# Altium project multi_channel.PrjPcb (part 1 of 2)
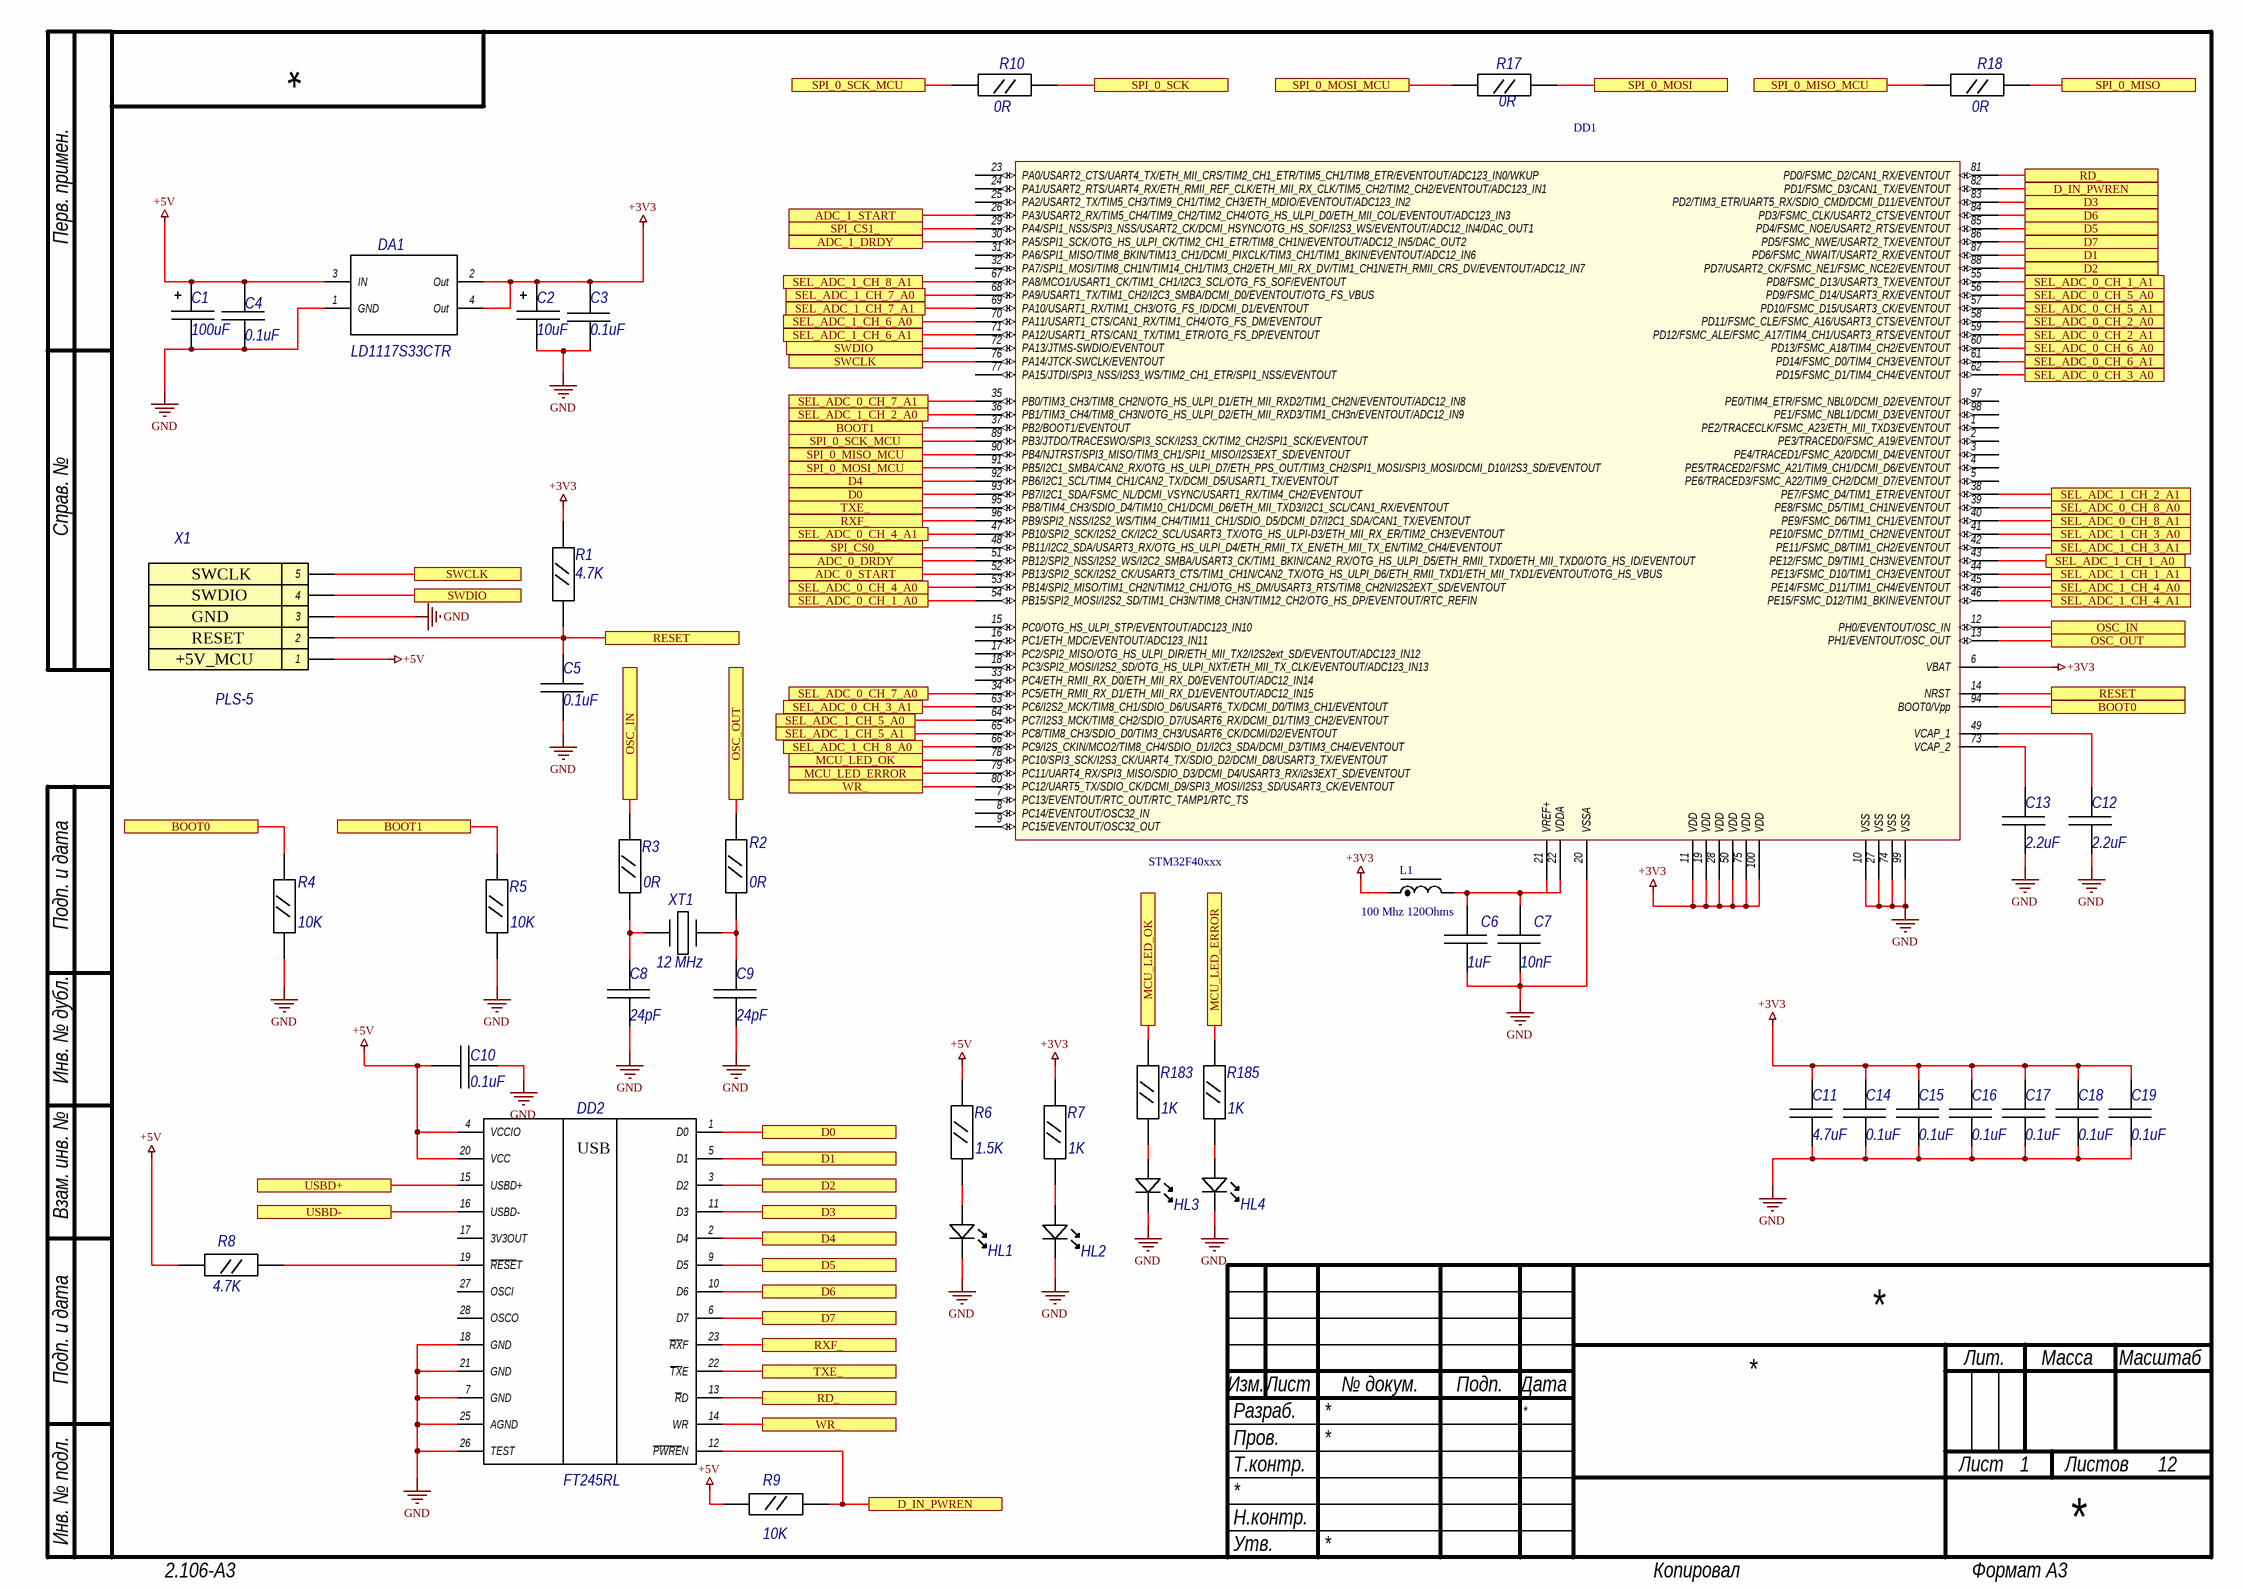
[diagram p0: MCU.SchDoc]
13 sheets, 471 parts. Net scope: flat (ports and power ports of the same name join across sheets).
Board file: multi_channel_pcb.PcbDoc
Sheets:
  MCU.SchDoc
  ADC_0.SchDoc
  ADC_0_MUL.SchDoc
  ADC_1.SchDoc
  ADC_1_MUL.SchDoc
  Filter1.SchDoc
  Filter2.SchDoc
  Filter3.SchDoc
  Filter4.SchDoc
  Filter5.SchDoc
  Filter6.SchDoc
  Connectors.SchDoc
  Filter7.SchDoc

## Sheet MCU.SchDoc
size 420 x 297 mm; SheetNumber: 1; SheetTotal: 12

### Parts
C1  100uF  [CT_SMD_A]
C2  10uF  [CT_SMD_A]
C3  0.1uF  [C0603]
C4  0.1uF  [C0603]
C5  0.1uF  [C0603]
C6  1uF  [C0603]
C7  10nF  [C0603]
C8  24pF  [C0603]
C9  24pF  [C0603]
C10  0.1uF  [C0603]
C11  4.7uF  [C0603]
C12  2.2uF  [C0603]
C13  2.2uF  [C0603]
C14  0.1uF  [C0603]
C15  0.1uF  [C0603]
C16  0.1uF  [C0603]
C17  0.1uF  [C0603]
C18  0.1uF  [C0603]
C19  0.1uF  [C0603]
DA1  LD1117S33CTR  [SOT-223(DCY)]
DD1  STM32F40xxx  [QFP50P1600X1600X160-100N]
DD2  FT245RL  [SSOP-28N]
HL1  GREEN  [LED_0603]  (value not drawn)
HL2  GREEN  [LED_0603]  (value not drawn)
HL3  GREEN  [LED_0603]  (value not drawn)
HL4  GREEN  [LED_0603]  (value not drawn)
L1  100 Mhz 120Ohms  [0805]
R1  4.7K  [R0603]
R2  0R  [R0603]
R3  0R  [R0603]
R4  10K  [R0603]
R5  10K  [R0603]
R6  1.5K  [R0603]
R7  1K  [R0603]
R8  4.7K  [R0603]
R9  10K  [R0603]
R10  0R  [R0603]
R17  0R  [R0603]
R18  0R  [R0603]
R183  1K  [R0603]
R185  1K  [R0603]
X1  PLS-5  [PLS-5]
XT1  12 MHz  [HC49/US]

### Ports
ADC_0_DRDY, ADC_0_START, ADC_1_DRDY, ADC_1_START, BOOT0, BOOT1, D0, D1, D2, D3, D4, D5, D6, D7, D_IN_PWREN, MCU_LED_ERROR, MCU_LED_OK, OSC_IN, OSC_OUT, RD_, RESET, RXF_, SEL_ADC_0_CH_1_A0, SEL_ADC_0_CH_1_A1, SEL_ADC_0_CH_2_A0, SEL_ADC_0_CH_2_A1, SEL_ADC_0_CH_3_A0, SEL_ADC_0_CH_3_A1, SEL_ADC_0_CH_4_A0, SEL_ADC_0_CH_4_A1, SEL_ADC_0_CH_5_A0, SEL_ADC_0_CH_5_A1, SEL_ADC_0_CH_6_A0, SEL_ADC_0_CH_6_A1, SEL_ADC_0_CH_7_A0, SEL_ADC_0_CH_7_A1, SEL_ADC_0_CH_8_A0, SEL_ADC_0_CH_8_A1, SEL_ADC_1_CH_1_A0, SEL_ADC_1_CH_1_A1, SEL_ADC_1_CH_2_A0, SEL_ADC_1_CH_2_A1, SEL_ADC_1_CH_3_A0, SEL_ADC_1_CH_3_A1, SEL_ADC_1_CH_4_A0, SEL_ADC_1_CH_4_A1, SEL_ADC_1_CH_5_A0, SEL_ADC_1_CH_5_A1, SEL_ADC_1_CH_6_A0, SEL_ADC_1_CH_6_A1, SEL_ADC_1_CH_7_A0, SEL_ADC_1_CH_7_A1, SEL_ADC_1_CH_8_A0, SEL_ADC_1_CH_8_A1, SPI_0_MISO, SPI_0_MISO_MCU, SPI_0_MOSI, SPI_0_MOSI_MCU, SPI_0_SCK, SPI_0_SCK_MCU, SPI_CS0_, SPI_CS1_, SWCLK, SWDIO, TXE_, USBD+, USBD-, WR_

### Nets
+3V3: C2.1 C3.2 C11.2 C14.2 C15.2 C16.2 C17.2 C18.2 C19.2 DA1.2(Out) DA1.4(Out) DD1.6(VBAT) DD1.11(VDD) DD1.19(VDD) DD1.28(VDD) DD1.50(VDD) DD1.75(VDD) DD1.100(VDD) L1.1 R1.2 R7.2
+5V: C1.1 C4.2 C10.2 DA1.3(IN) DD2.4(VCCIO) DD2.20(VCC) R6.2 R8.2 R9.1 X1.1
GND: C1.2 C2.2 C3.1 C4.1 C5.1 C6.1 C7.1 C8.1 C9.1 C10.1 C11.1 C12.1 C13.1 C14.1 C15.1 C16.1 C17.1 C18.1 C19.1 DA1.1(GND) DD1.10(VSS) DD1.20(VSSA) DD1.27(VSS) DD1.74(VSS) DD1.99(VSS) DD2.7(GND) DD2.18(GND) DD2.21(GND) DD2.25(AGND) DD2.26(TEST) HL1.K HL2.K HL3.K HL4.K R4.1 R5.1 X1.3
NetB1_34: R17.1 ; port SPI_0_MOSI
NetB1_38: DD1.52(PB13/SPI2_SCK/I2S2_CK/USART3_CTS/TIM1_CH1N/CAN2_TX/OTG_HS_ULPI_D6/ETH_RMII_TXD1/ETH_MII_TXD1/EVENTOUT/OTG_HS_VBUS) ; port ADC_0_START
NetB1_39: DD1.48(PB11/I2C2_SDA/USART3_RX/OTG_HS_ULPI_D4/ETH_RMII_TX_EN/ETH_MII_TX_EN/TIM2_CH4/EVENTOUT) ; port SPI_CS0_
NetB1_40: R10.1 ; port SPI_0_SCK
NetB1_43: R18.1 ; port SPI_0_MISO
NetB1_47: DD1.51(PB12/SPI2_NSS/I2S2_WS/I2C2_SMBA/USART3_CK/TIM1_BKIN/CAN2_RX/OTG_HS_ULPI_D5/ETH_RMII_TXD0/ETH_MII_TXD0/OTG_HS_ID/EVENTOUT) ; port ADC_0_DRDY
NetB2_38: DD1.26(PA3/USART2_RX/TIM5_CH4/TIM9_CH2/TIM2_CH4/OTG_HS_ULPI_D0/ETH_MII_COL/EVENTOUT/ADC123_IN3) ; port ADC_1_START
NetB2_39: DD1.29(PA4/SPI1_NSS/SPI3_NSS/USART2_CK/DCMI_HSYNC/OTG_HS_SOF/I2S3_WS/EVENTOUT/ADC12_IN4/DAC_OUT1) ; port SPI_CS1_
NetB2_47: DD1.30(PA5/SPI1_SCK/OTG_HS_ULPI_CK/TIM2_CH1_ETR/TIM8_CH1N/EVENTOUT/ADC12_IN5/DAC_OUT2) ; port ADC_1_DRDY
NetC5_2: C5.2 DD1.14(NRST) R1.1 X1.2 ; port RESET
NetC6_2: C6.2 C7.2 DD1.21(VREF+) DD1.22(VDDA) L1.2
NetC8_2: C8.2 R3.1 XT1.2(OUT)
NetC9_2: C9.2 R2.1 XT1.1(IN)
NetC12_2: C12.2 DD1.49(VCAP_1)
NetC13_2: C13.2 DD1.73(VCAP_2)
NetDD1_12: DD1.12(PH0/EVENTOUT/OSC_IN) R3.2 ; port OSC_IN
NetDD1_13: DD1.13(PH1/EVENTOUT/OSC_OUT) R2.2 ; port OSC_OUT
NetDD1_34: DD1.34(PC5/ETH_RMII_RX_D1/ETH_MII_RX_D1/EVENTOUT/ADC12_IN15) ; port SEL_ADC_0_CH_7_A0
NetDD1_35: DD1.35(PB0/TIM3_CH3/TIM8_CH2N/OTG_HS_ULPI_D1/ETH_MII_RXD2/TIM1_CH2N/EVENTOUT/ADC12_IN8) ; port SEL_ADC_0_CH_7_A1
NetDD1_36: DD1.36(PB1/TIM3_CH4/TIM8_CH3N/OTG_HS_ULPI_D2/ETH_MII_RXD3/TIM1_CH3n/EVENTOUT/ADC12_IN9) ; port SEL_ADC_1_CH_2_A0
NetDD1_37: DD1.37(PB2/BOOT1/EVENTOUT) R5.2 ; port BOOT1
NetDD1_38: DD1.38(PE7/FSMC_D4/TIM1_ETR/EVENTOUT) ; port SEL_ADC_1_CH_2_A1
NetDD1_39: DD1.39(PE8/FSMC_D5/TIM1_CH1N/EVENTOUT) ; port SEL_ADC_0_CH_8_A0
NetDD1_40: DD1.40(PE9/FSMC_D6/TIM1_CH1/EVENTOUT) ; port SEL_ADC_0_CH_8_A1
NetDD1_41: DD1.41(PE10/FSMC_D7/TIM1_CH2N/EVENTOUT) ; port SEL_ADC_1_CH_3_A0
NetDD1_42: DD1.42(PE11/FSMC_D8/TIM1_CH2/EVENTOUT) ; port SEL_ADC_1_CH_3_A1
NetDD1_43: DD1.43(PE12/FSMC_D9/TIM1_CH3N/EVENTOUT) ; port SEL_ADC_1_CH_1_A0
NetDD1_44: DD1.44(PE13/FSMC_D10/TIM1_CH3/EVENTOUT) ; port SEL_ADC_1_CH_1_A1
NetDD1_45: DD1.45(PE14/FSMC_D11/TIM1_CH4/EVENTOUT) ; port SEL_ADC_1_CH_4_A0
NetDD1_46: DD1.46(PE15/FSMC_D12/TIM1_BKIN/EVENTOUT) ; port SEL_ADC_1_CH_4_A1
NetDD1_47: DD1.47(PB10/SPI2_SCK/I2S2_CK/I2C2_SCL/USART3_TX/OTG_HS_ULPI-D3/ETH_MII_RX_ER/TIM2_CH3/EVENTOUT) ; port SEL_ADC_0_CH_4_A1
NetDD1_53: DD1.53(PB14/SPI2_MISO/TIM1_CH2N/TIM12_CH1/OTG_HS_DM/USART3_RTS/TIM8_CH2N/I2S2EXT_SD/EVENTOUT) ; port SEL_ADC_0_CH_4_A0
NetDD1_54: DD1.54(PB15/SPI2_MOSI/I2S2_SD/TIM1_CH3N/TIM8_CH3N/TIM12_CH2/OTG_HS_DP/EVENTOUT/RTC_REFIN) ; port SEL_ADC_0_CH_1_A0
NetDD1_55: DD1.55(PD8/FSMC_D13/USART3_TX/EVENTOUT) ; port SEL_ADC_0_CH_1_A1
NetDD1_56: DD1.56(PD9/FSMC_D14/USART3_RX/EVENTOUT) ; port SEL_ADC_0_CH_5_A0
NetDD1_57: DD1.57(PD10/FSMC_D15/USART3_CK/EVENTOUT) ; port SEL_ADC_0_CH_5_A1
NetDD1_58: DD1.58(PD11/FSMC_CLE/FSMC_A16/USART3_CTS/EVENTOUT) ; port SEL_ADC_0_CH_2_A0
NetDD1_59: DD1.59(PD12/FSMC_ALE/FSMC_A17/TIM4_CH1/USART3_RTS/EVENTOUT) ; port SEL_ADC_0_CH_2_A1
NetDD1_60: DD1.60(PD13/FSMC_A18/TIM4_CH2/EVENTOUT) ; port SEL_ADC_0_CH_6_A0
NetDD1_61: DD1.61(PD14/FSMC_D0/TIM4_CH3/EVENTOUT) ; port SEL_ADC_0_CH_6_A1
NetDD1_62: DD1.62(PD15/FSMC_D1/TIM4_CH4/EVENTOUT) ; port SEL_ADC_0_CH_3_A0
NetDD1_63: DD1.63(PC6/I2S2_MCK/TIM8_CH1/SDIO_D6/USART6_TX/DCMI_D0/TIM3_CH1/EVENTOUT) ; port SEL_ADC_0_CH_3_A1
NetDD1_64: DD1.64(PC7/I2S3_MCK/TIM8_CH2/SDIO_D7/USART6_RX/DCMI_D1/TIM3_CH2/EVENTOUT) ; port SEL_ADC_1_CH_5_A0
NetDD1_65: DD1.65(PC8/TIM8_CH3/SDIO_D0/TIM3_CH3/USART6_CK/DCMI/D2/EVENTOUT) ; port SEL_ADC_1_CH_5_A1
NetDD1_66: DD1.66(PC9/I2S_CKIN/MCO2/TIM8_CH4/SDIO_D1/I2C3_SDA/DCMI_D3/TIM3_CH4/EVENTOUT) ; port SEL_ADC_1_CH_8_A0
NetDD1_67: DD1.67(PA8/MCO1/USART1_CK/TIM1_CH1/I2C3_SCL/OTG_FS_SOF/EVENTOUT) ; port SEL_ADC_1_CH_8_A1
NetDD1_68: DD1.68(PA9/USART1_TX/TIM1_CH2/I2C3_SMBA/DCMI_D0/EVENTOUT/OTG_FS_VBUS) ; port SEL_ADC_1_CH_7_A0
NetDD1_69: DD1.69(PA10/USART1_RX/TIM1_CH3/OTG_FS_ID/DCMI_D1/EVENTOUT) ; port SEL_ADC_1_CH_7_A1
NetDD1_70: DD1.70(PA11/USART1_CTS/CAN1_RX/TIM1_CH4/OTG_FS_DM/EVENTOUT) ; port SEL_ADC_1_CH_6_A0
NetDD1_71: DD1.71(PA12/USART1_RTS/CAN1_TX/TIM1_ETR/OTG_FS_DP/EVENTOUT) ; port SEL_ADC_1_CH_6_A1
NetDD1_72: DD1.72(PA13/JTMS-SWDIO/EVENTOUT) X1.4 ; port SWDIO
NetDD1_76: DD1.76(PA14/JTCK-SWCLK/EVENTOUT) X1.5 ; port SWCLK
NetDD1_78: DD1.78(PC10/SPI3_SCK/I2S3_CK/UART4_TX/SDIO_D2/DCMI_D8/USART3_TX/EVENTOUT) R183.2 ; port MCU_LED_OK
NetDD1_79: DD1.79(PC11/UART4_RX/SPI3_MISO/SDIO_D3/DCMI_D4/USART3_RX/i2s3EXT_SD/EVENTOUT) R185.2 ; port MCU_LED_ERROR
NetDD1_80: DD1.80(PC12/UART5_TX/SDIO_CK/DCMI_D9/SPI3_MOSI/I2S3_SD/USART3_CK/EVENTOUT) DD2.14(WR) ; port WR_
NetDD1_81: DD1.81(PD0/FSMC_D2/CAN1_RX/EVENTOUT) DD2.13(~{R}D) ; port RD_
NetDD1_82: DD1.82(PD1/FSMC_D3/CAN1_TX/EVENTOUT) DD2.12(~{PWRE}N) R9.2 ; port D_IN_PWREN
NetDD1_83: DD1.83(PD2/TIM3_ETR/UART5_RX/SDIO_CMD/DCMI_D11/EVENTOUT) DD2.11(D3) ; port D3
NetDD1_84: DD1.84(PD3/FSMC_CLK/USART2_CTS/EVENTOUT) DD2.10(D6) ; port D6
NetDD1_85: DD1.85(PD4/FSMC_NOE/USART2_RTS/EVENTOUT) DD2.9(D5) ; port D5
NetDD1_86: DD1.86(PD5/FSMC_NWE/USART2_TX/EVENTOUT) DD2.6(D7) ; port D7
NetDD1_87: DD1.87(PD6/FSMC_NWAIT/USART2_RX/EVENTOUT) DD2.5(D1) ; port D1
NetDD1_88: DD1.88(PD7/USART2_CK/FSMC_NE1/FSMC_NCE2/EVENTOUT) DD2.3(D2) ; port D2
NetDD1_89: DD1.89(PB3/JTDO/TRACESWO/SPI3_SCK/I2S3_CK/TIM2_CH2/SPI1_SCK/EVENTOUT) R10.2 ; port SPI_0_SCK_MCU
NetDD1_90: DD1.90(PB4/NJTRST/SPI3_MISO/TIM3_CH1/SPI1_MISO/I2S3EXT_SD/EVENTOUT) R18.2 ; port SPI_0_MISO_MCU
NetDD1_91: DD1.91(PB5/I2C1_SMBA/CAN2_RX/OTG_HS_ULPI_D7/ETH_PPS_OUT/TIM3_CH2/SPI1_MOSI/SPI3_MOSI/DCMI_D10/I2S3_SD/EVENTOUT) R17.2 ; port SPI_0_MOSI_MCU
NetDD1_92: DD1.92(PB6/I2C1_SCL/TIM4_CH1/CAN2_TX/DCMI_D5/USART1_TX/EVENTOUT) DD2.2(D4) ; port D4
NetDD1_93: DD1.93(PB7/I2C1_SDA/FSMC_NL/DCMI_VSYNC/USART1_RX/TIM4_CH2/EVENTOUT) DD2.1(D0) ; port D0
NetDD1_94: DD1.94(BOOT0/Vpp) R4.2 ; port BOOT0
NetDD1_95: DD1.95(PB8/TIM4_CH3/SDIO_D4/TIM10_CH1/DCMI_D6/ETH_MII_TXD3/I2C1_SCL/CAN1_RX/EVENTOUT) DD2.22(~{TX}E) ; port TXE_
NetDD1_96: DD1.96(PB9/SPI2_NSS/I2S2_WS/TIM4_CH4/TIM11_CH1/SDIO_D5/DCMI_D7/I2C1_SDA/CAN1_TX/EVENTOUT) DD2.23(~{RX}F) ; port RXF_
NetDD2_15: DD2.15(USBD+) ; port USBD+
NetDD2_16: DD2.16(USBD-) ; port USBD-
NetDD2_19: DD2.19(~{RESE}T) R8.1
NetHL1_A: HL1.A R6.1
NetHL2_A: HL2.A R7.1
NetHL3_A: HL3.A R183.1
NetHL4_A: HL4.A R185.1

Not connected (* = marked no-connect by the designer): DD1 1(PE2/TRACECLK/FSMC_A23/ETH_MII_TXD3/EVENTOUT) 2(PE3/TRACED0/FSMC_A19/EVENTOUT) 3(PE4/TRACED1/FSMC_A20/DCMI_D4/EVENTOUT) 4(PE5/TRACED2/FSMC_A21/TIM9_CH1/DCMI_D6/EVENTOUT) 5(PE6/TRACED3/FSMC_A22/TIM9_CH2/DCMI_D7/EVENTOUT) 7(PC13/EVENTOUT/RTC_OUT/RTC_TAMP1/RTC_TS) 8(PC14/EVENTOUT/OSC32_IN) 9(PC15/EVENTOUT/OSC32_OUT) 15(PC0/OTG_HS_ULPI_STP/EVENTOUT/ADC123_IN10) 16(PC1/ETH_MDC/EVENTOUT/ADC123_IN11) 17(PC2/SPI2_MISO/OTG_HS_ULPI_DIR/ETH_MII_TX2/I2S2ext_SD/EVENTOUT/ADC123_IN12) 18(PC3/SPI2_MOSI/I2S2_SD/OTG_HS_ULPI_NXT/ETH_MII_TX_CLK/EVENTOUT/ADC123_IN13) 23(PA0/USART2_CTS/UART4_TX/ETH_MII_CRS/TIM2_CH1_ETR/TIM5_CH1/TIM8_ETR/EVENTOUT/ADC123_IN0/WKUP) 24(PA1/USART2_RTS/UART4_RX/ETH_RMII_REF_CLK/ETH_MII_RX_CLK/TIM5_CH2/TIM2_CH2/EVENTOUT/ADC123_IN1) 25(PA2/USART2_TX/TIM5_CH3/TIM9_CH1/TIM2_CH3/ETH_MDIO/EVENTOUT/ADC123_IN2) 31(PA6/SPI1_MISO/TIM8_BKIN/TIM13_CH1/DCMI_PIXCLK/TIM3_CH1/TIM1_BKIN/EVENTOUT/ADC12_IN6) 32(PA7/SPI1_MOSI/TIM8_CH1N/TIM14_CH1/TIM3_CH2/ETH_MII_RX_DV/TIM1_CH1N/ETH_RMII_CRS_DV/EVENTOUT/ADC12_IN7) 33(PC4/ETH_RMII_RX_D0/ETH_MII_RX_D0/EVENTOUT/ADC12_IN14) 77(PA15/JTDI/SPI3_NSS/I2S3_WS/TIM2_CH1_ETR/SPI1_NSS/EVENTOUT) 97(PE0/TIM4_ETR/FSMC_NBL0/DCMI_D2/EVENTOUT) 98(PE1/FSMC_NBL1/DCMI_D3/EVENTOUT); DD2 17(3V3OUT) 27(OSCI) 28(OSCO)

### Notes on the sheet
- SWCLK
- +5V_MCU
- RESET
- GND
- SWDIO
- Перв. примен.
- Справ. №
- Подп. и дата
- Инв. № дубл.
- Взам. инв. №
- Разраб.
- Изм.
- Лист
- № докум.
- Подп.
- Дата
- Лит.
- Масса
- Масштаб
- Пров.
- Т.контр.
- Листов
- Инв. № подл.
- Утв.
- Н.контр.
- 2.106-A3
- Копировал
- Формат А3
- (in symbol FT245RL) USB

### Library data of the parts
C1 C2 = CT_SMD_A: Capacitor tantalum; Package: SMD_A
  C1: Value: 100uF
  C2: Value: 10uF
C3-C19 = CC_SMD_0603: Ceramic Capacitor SMD; Package: 0603
  C3-C5 C10 C14-C19: Value: 0.1uF
  C6: Value: 1uF
  C7: Value: 10nF
  C8 C9: Value: 24pF
  C11: Value: 4.7uF
  C12 C13: Value: 2.2uF
DA1 = LD1117S33CTR: LDO; PartNumber: LD1117S33CTR; Package: SOT-223
DD1 = STM32F40xxx: ARM CortexM4 32b
DD2 = FT245RL: USB to parallel FIFO interface; Manufacturer: FTDI; Desc: Микросхема; Part Number: FT245RL; Package: 28 Pin SSOP
HL1-HL4 = LED_G_SMD_0603: LED GREEN SMD 0603; PartNumber: FYLS-0603PGC; Package: 0603; ComponentLink1URL: http://www.us.kingbright.com/images/catalog/SPEC/APT1608CGCK.pdf; ComponentLink1Description: http://www.us.kingbright.com/images/catalog/SPEC/APT1608CGCK.pdf; Color: GREEN
L1 = FerriteBead_0805: FerriteBead; PartNumber: BLM21PG121SN1D; Package: 0805; Value: 100 Mhz 120Ohms
R1-R10 R17 R18 R183 R185 = R0603: Resistor SMD
  R1 R8: Value: 4.7K
  R2 R3 R10 R17 R18: Value: 0R
  R4 R5 R9: Value: 10K
  R6: Value: 1.5K
  R7 R183 R185: Value: 1K
X1 = PLS-5: 5 pin connector, 2.54 step; PartNumber: 825433-5; Value: PLS-5
XT1 = Quarz HC-49/US 12 MHz: Quarz ESR 50 Ohms, Frequency Stability ±30ppm, Load Capacitance 18 pF; PartNumber: J49SML-F-G-G-K-12M0; Package: HC49/US; ComponentLink1Description: Link; ComponentLink1URL: https://abracon.com/Resonators/ABLS2.pdf; Value: 12 MHz

## Sheet ADC_0.SchDoc
size 420 x 297 mm; SheetNumber: 2; SheetTotal: 13
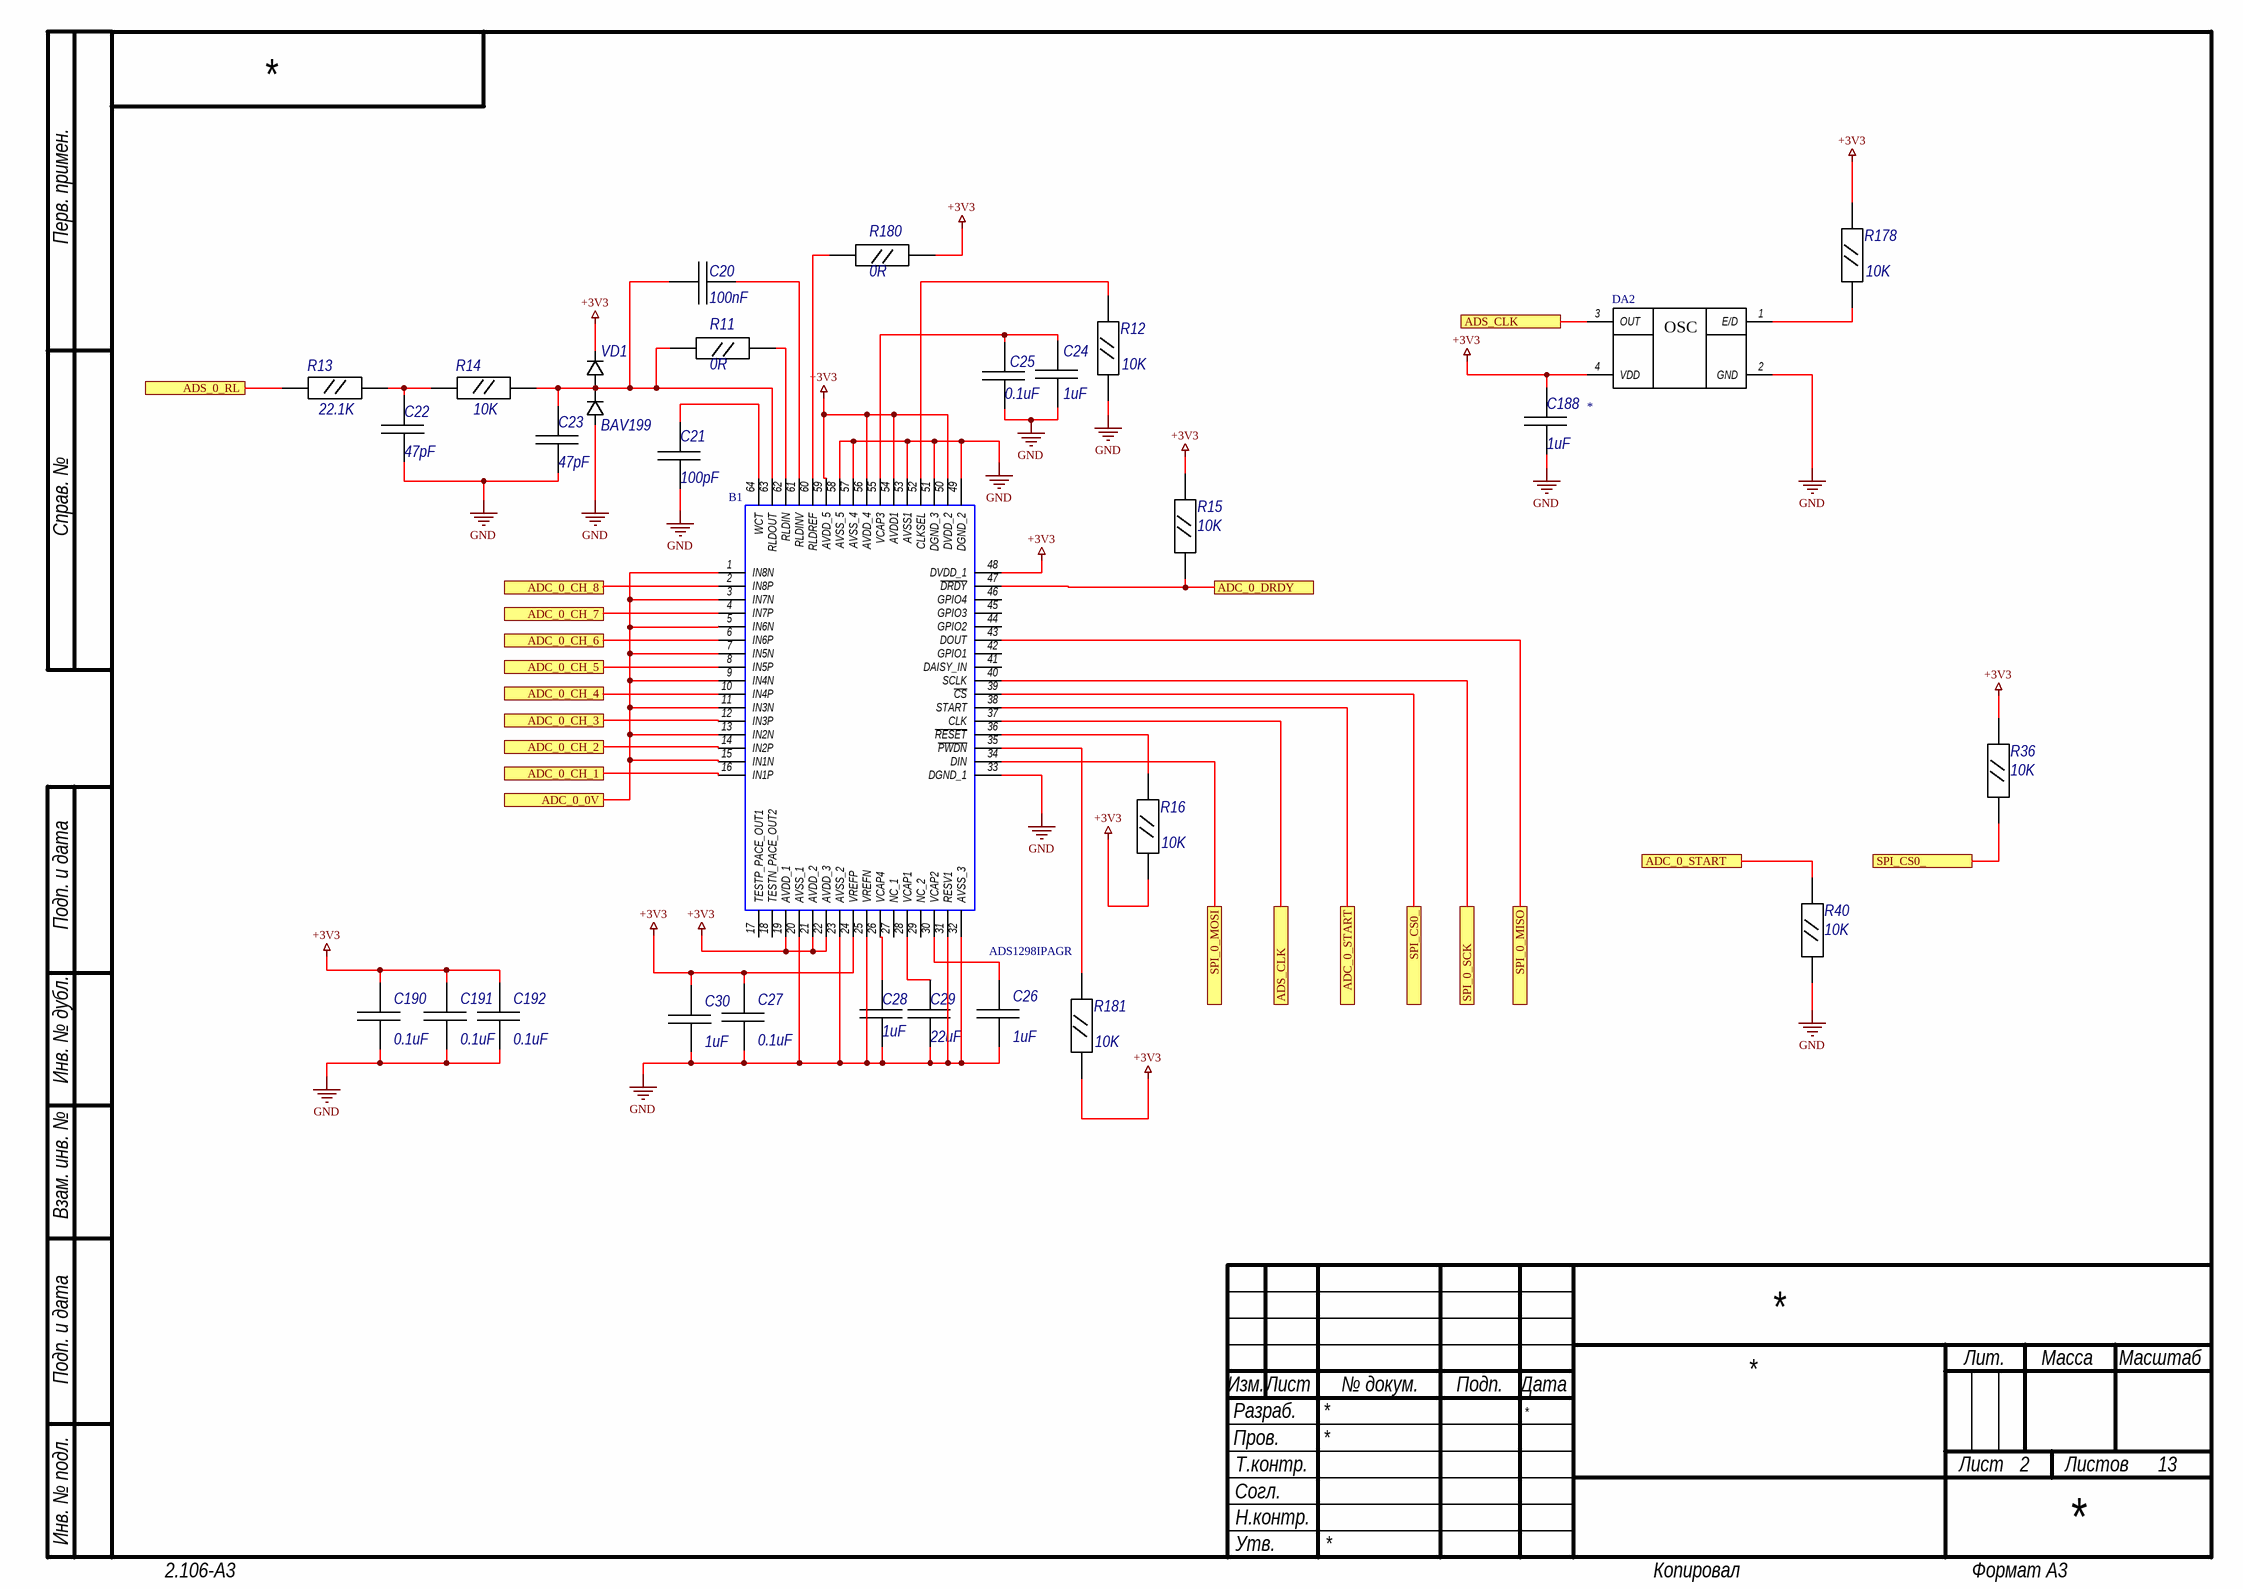
[diagram p1: ADC_0.SchDoc]

### Parts
B1  ADS1298IPAGR  [QFP50P1200X1200X120-64N]
C20  100nF  [C0603]
C21  100pF  [C0603]
C22  47pF  [C0603]
C23  47pF  [C0603]
C24  1uF  [C0603]
C25  0.1uF  [C0603]
C26  1uF  [C0603]
C27  0.1uF  [C0603]
C28  1uF  [C0603]
C29  22uF  [C0603]
C30  1uF  [C0603]
C188  1uF  [C0603]
C190  0.1uF  [C0603]
C191  0.1uF  [C0603]
C192  0.1uF  [C0603]
DA2  *  [Quartz 3.2х3.5х0.8]
R11  0R  [R0603]
R12  10K  [R0603]
R13  22.1K  [R0603]
R14  10K  [R0603]
R15  10K  [R0603]
R16  10K  [R0603]
R36  10K  [R0603]
R40  10K  [R0603]
R178  10K  [R0603]
R180  0R  [R0603]
R181  10K  [R0603]
VD1  BAV199  [SOT23]

### Ports
ADC_0_0V, ADC_0_CH_1, ADC_0_CH_2, ADC_0_CH_3, ADC_0_CH_4, ADC_0_CH_5, ADC_0_CH_6, ADC_0_CH_7, ADC_0_CH_8, ADC_0_DRDY, ADC_0_START, ADS_0_RL, ADS_CLK, SPI_0_MISO, SPI_0_MOSI, SPI_0_SCK, SPI_CS0_

### Nets
+3V3: B1.19(AVDD_1) B1.21(AVDD_2) B1.22(AVDD_3) B1.24(VREFP) B1.48(DVDD_1) B1.50(DVDD_2) B1.54(AVDD1) B1.56(AVDD_4) B1.59(AVDD_5) C27.2 C30.2 C188.2 C190.2 C191.2 C192.2 DA2.4(VDD) R15.2 R16.1 R36.2 R178.2 R180.1 R181.1 VD1.2
GND: B1.20(AVSS_1) B1.23(AVSS_2) B1.25(VREFN) B1.31(RESV1) B1.32(AVSS_3) B1.33(DGND_1) B1.49(DGND_2) B1.51(DGND_3) B1.53(AVSS1) B1.57(AVSS_4) B1.58(AVSS_5) C21.1 C22.1 C23.1 C24.1 C25.1 C26.1 C27.1 C28.1 C29.1 C30.1 C188.1 C190.1 C191.1 C192.1 DA2.2(GND) R12.1 R40.1 VD1.1
NetB1_1: B1.1(IN8N) B1.3(IN7N) B1.5(IN6N) B1.7(IN5N) B1.9(IN4N) B1.11(IN3N) B1.13(IN2N) B1.15(IN1N) ; port ADC_0_0V
NetB1_2: B1.2(IN8P) ; port ADC_0_CH_8
NetB1_4: B1.4(IN7P) ; port ADC_0_CH_7
NetB1_6: B1.6(IN6P) ; port ADC_0_CH_6
NetB1_8: B1.8(IN5P) ; port ADC_0_CH_5
NetB1_10: B1.10(IN4P) ; port ADC_0_CH_4
NetB1_12: B1.12(IN3P) ; port ADC_0_CH_3
NetB1_14: B1.14(IN2P) ; port ADC_0_CH_2
NetB1_16: B1.16(IN1P) ; port ADC_0_CH_1
NetB1_26: B1.26(VCAP4) C28.2
NetB1_28: B1.28(VCAP1) C29.2
NetB1_30: B1.30(VCAP2) C26.2
NetB1_34: B1.34(DIN) ; port SPI_0_MOSI
NetB1_35: B1.35(~{PWDN}) R181.2
NetB1_36: B1.36(~{RESET}) R16.2
NetB1_37: B1.37(CLK) DA2.3(OUT) ; port ADS_CLK
NetB1_38: B1.38(START) R40.2 ; port ADC_0_START
NetB1_39: B1.39(~{CS}) R36.1 ; port SPI_CS0_
NetB1_40: B1.40(SCLK) ; port SPI_0_SCK
NetB1_43: B1.43(DOUT) ; port SPI_0_MISO
NetB1_47: B1.47(~{DRDY}) R15.1 ; port ADC_0_DRDY
NetB1_52: B1.52(CLKSEL) R12.2
NetB1_55: B1.55(VCAP3) C24.2 C25.2
NetB1_60: B1.60(RLDREF) R180.2
NetB1_61: B1.61(RLDINV) C20.1
NetB1_62: B1.62(RLDIN) R11.1
NetB1_63: B1.63(RLDOUT) C20.2 C23.2 R11.2 R14.2 VD1.3
NetB1_64: B1.64(WCT) C21.2
NetC22_2: C22.2 R13.2 R14.1
NetDA2_1: DA2.1(E/D) R178.1
NetR13_1: R13.1 ; port ADS_0_RL

Not connected (* = marked no-connect by the designer): B1 17(TESTP_PACE_OUT1) 18(TESTN_PACE_OUT2) 27(NC_1) 29(NC_2) 41(DAISY_IN) 42(GPIO1) 44(GPIO2) 45(GPIO3) 46(GPIO4)

### Notes on the sheet
- Перв. примен.
- Справ. №
- Подп. и дата
- Инв. № дубл.
- Взам. инв. №
- Разраб.
- Изм.
- Лист
- № докум.
- Подп.
- Дата
- Лит.
- Масса
- Масштаб
- Пров.
- Т.контр.
- Листов
- Инв. № подл.
- Согл.
- Утв.
- Н.контр.
- 2.106-A3
- Копировал
- Формат А3
- (in symbol OSCILLATOR KX-7) OSC

### Library data of the parts
B1 = ADS1298IPAGR: 8-Channel 24-bit ADC With Integrated ECG Front End; Manufacturer_Name: Texas Instruments; Geometry.Height: 1.2mm; Mouser Part Number: 595-ADS1298IPAGR; Mouser Price/Stock: https://www.mouser.co.uk/ProductDetail/Texas-Instruments/ADS1298IPAGR?qs=Z6FgPJT5dDSzK7JhuKfPmw%3D%3D; Manufacturer_Part_Number: ADS1298IPAGR; Datasheet Link: http://www.ti.com/lit/ds/symlink/ads1294.pdf
C20-C30 C188 C190-C192 = CC_SMD_0603: Ceramic Capacitor SMD; Package: 0603
  C20: Value: 100nF
  C21: Value: 100pF
  C22 C23: Value: 47pF
  C24 C26 C28 C30 C188: Value: 1uF
  C25 C27 C190-C192: Value: 0.1uF
  C29: Value: 22uF
DA2 = OSCILLATOR KX-7: Oscillator; Value: *; Package: 4 Lead 3.2x3.5
R11-R16 R36 R40 R178 R180 R181 = R0603: Resistor SMD
  R11 R180: Value: 0R
  R12 R14-R16 R36 R40 R178 R181: Value: 10K
  R13: Value: 22.1K
VD1 = DIODE_BAV199: Diod Schottky; Diode Type: Standard; Package: SOT-23; PartNumber: BAV199; Manufacturer Part Number 1: BAV199

## Sheet ADC_0_MUL.SchDoc
size 420 x 297 mm; SheetNumber: 3; SheetTotal: 13
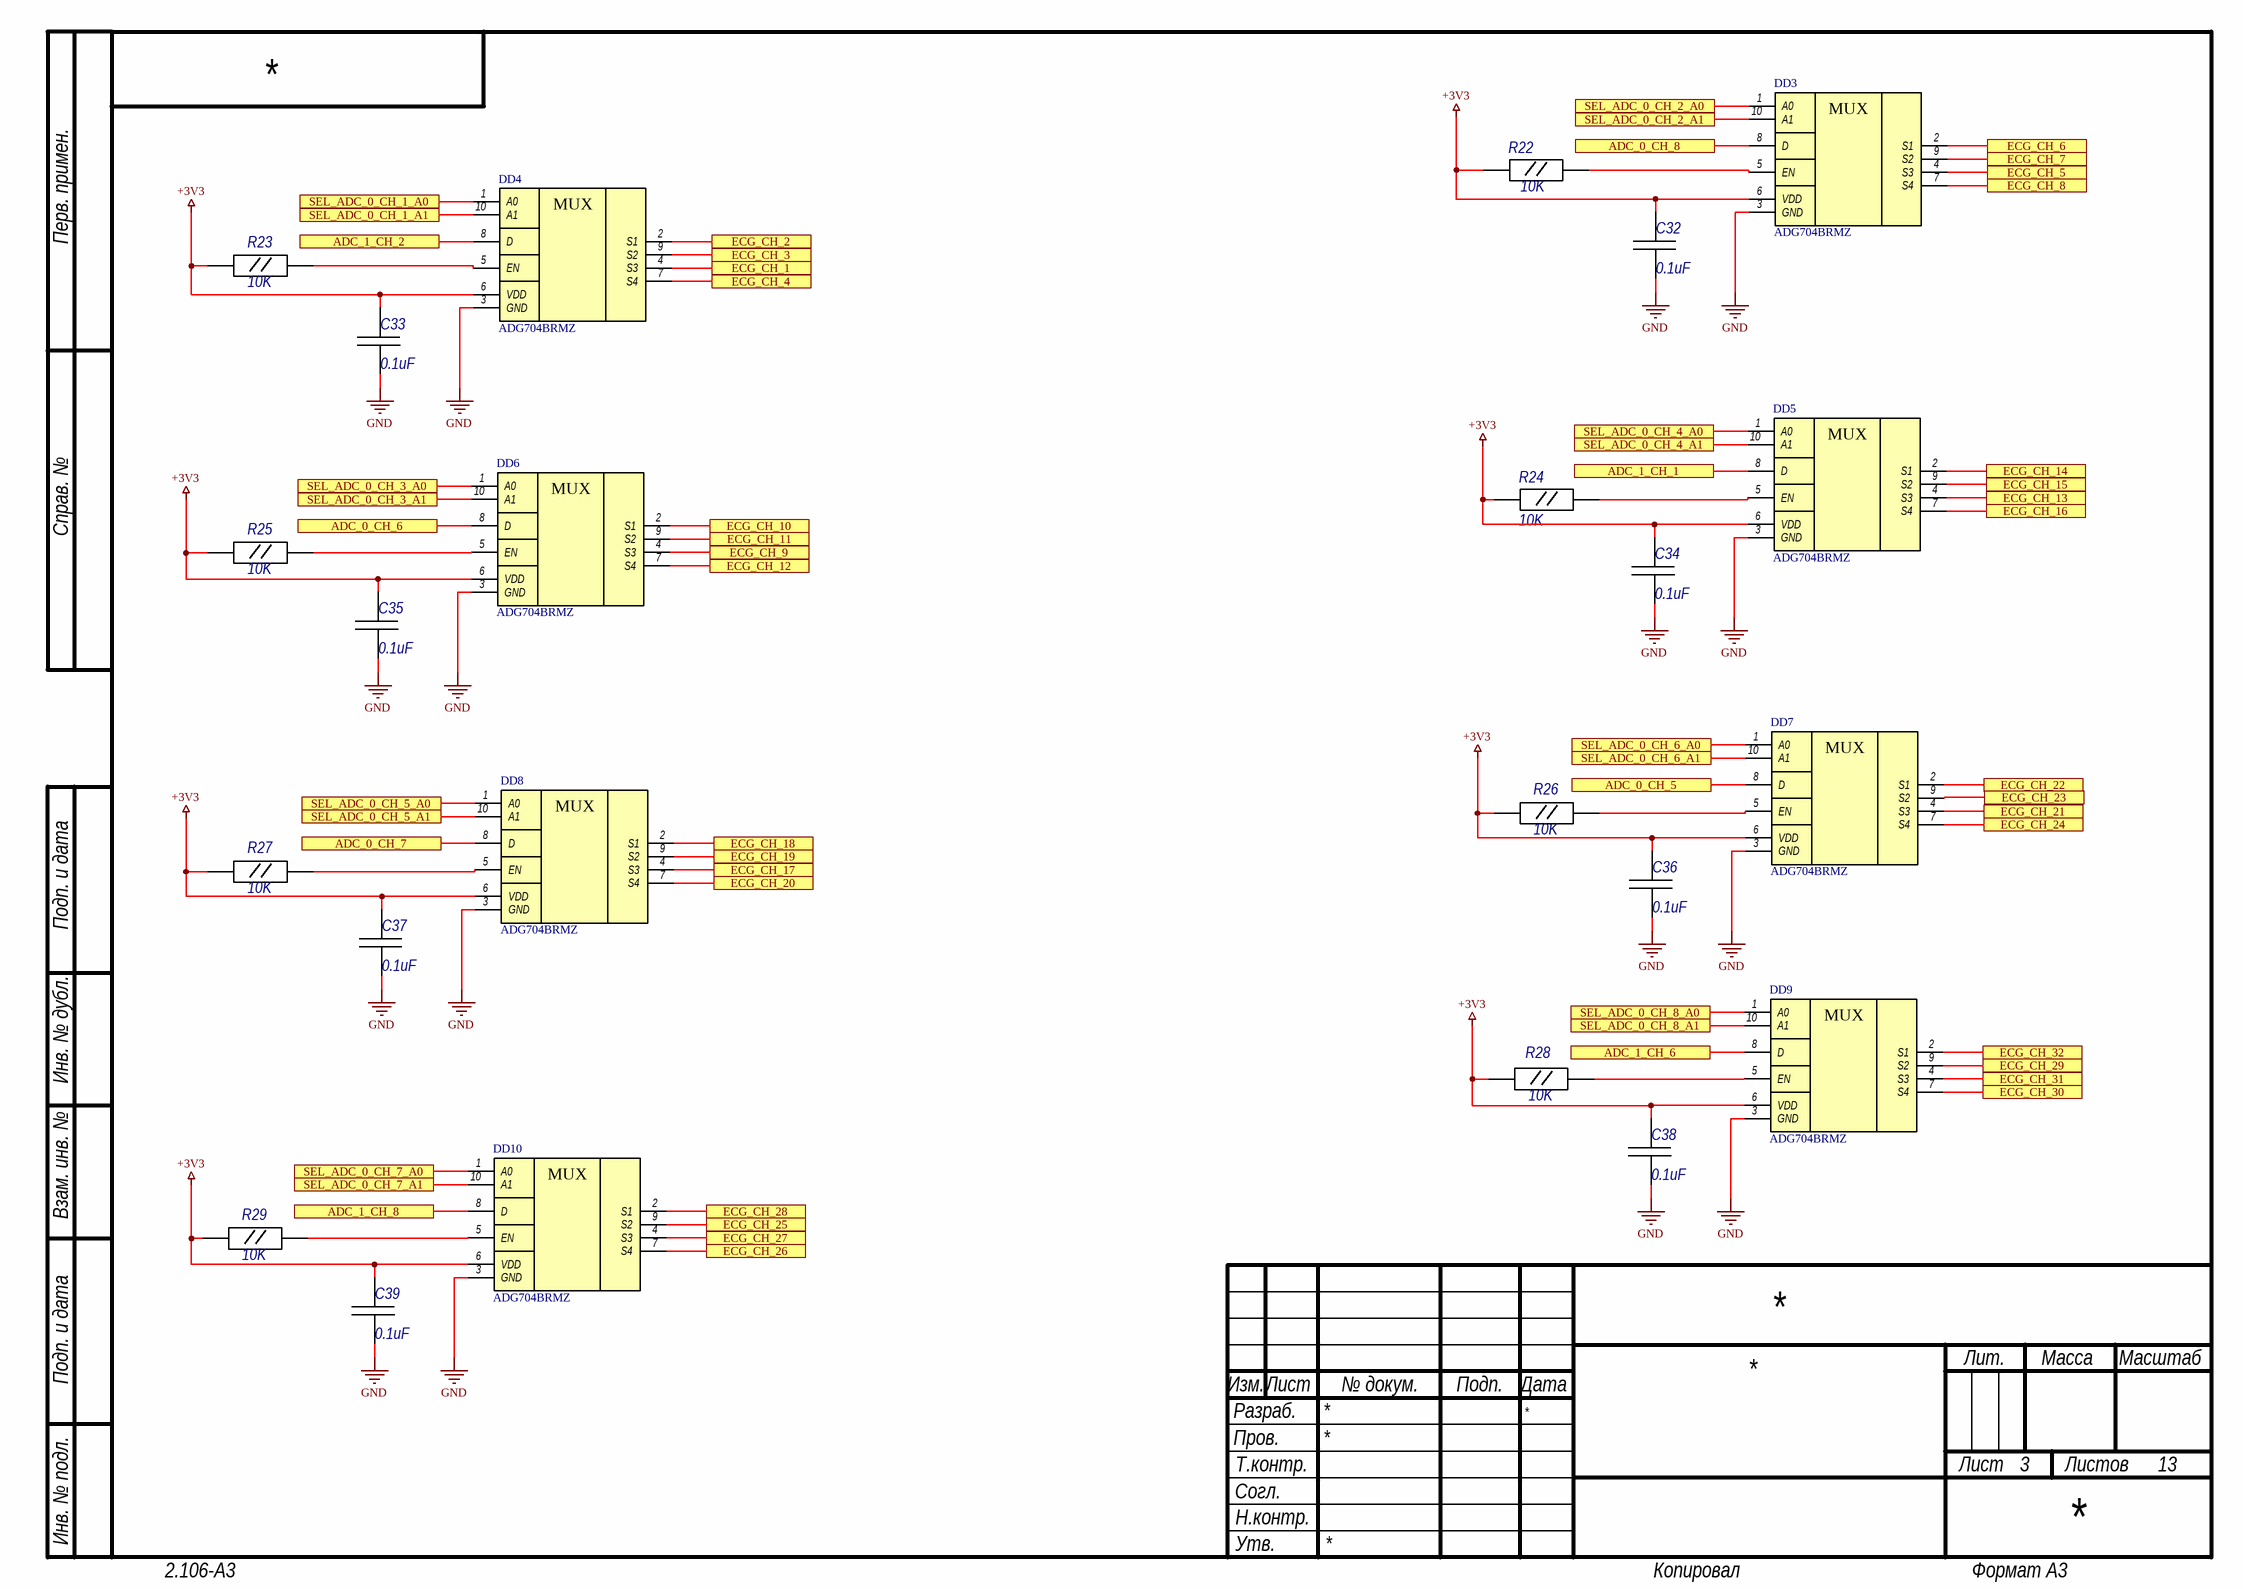
[diagram p2: ADC_0_MUL.SchDoc]

### Parts
C32  0.1uF  [C0603]
C33  0.1uF  [C0603]
C34  0.1uF  [C0603]
C35  0.1uF  [C0603]
C36  0.1uF  [C0603]
C37  0.1uF  [C0603]
C38  0.1uF  [C0603]
C39  0.1uF  [C0603]
DD3  ADG704BRMZ  [MSOP-10]
DD4  ADG704BRMZ  [MSOP-10]
DD5  ADG704BRMZ  [MSOP-10]
DD6  ADG704BRMZ  [MSOP-10]
DD7  ADG704BRMZ  [MSOP-10]
DD8  ADG704BRMZ  [MSOP-10]
DD9  ADG704BRMZ  [MSOP-10]
DD10  ADG704BRMZ  [MSOP-10]
R22  10K  [R0603]
R23  10K  [R0603]
R24  10K  [R0603]
R25  10K  [R0603]
R26  10K  [R0603]
R27  10K  [R0603]
R28  10K  [R0603]
R29  10K  [R0603]

### Ports
ADC_0_CH_5, ADC_0_CH_6, ADC_0_CH_7, ADC_0_CH_8, ADC_1_CH_1, ADC_1_CH_2, ADC_1_CH_6, ADC_1_CH_8, ECG_CH_1, ECG_CH_2, ECG_CH_3, ECG_CH_4, ECG_CH_5, ECG_CH_6, ECG_CH_7, ECG_CH_8, ECG_CH_9, ECG_CH_10, ECG_CH_11, ECG_CH_12, ECG_CH_13, ECG_CH_14, ECG_CH_15, ECG_CH_16, ECG_CH_17, ECG_CH_18, ECG_CH_19, ECG_CH_20, ECG_CH_21, ECG_CH_22, ECG_CH_23, ECG_CH_24, ECG_CH_25, ECG_CH_26, ECG_CH_27, ECG_CH_28, ECG_CH_29, ECG_CH_30, ECG_CH_31, ECG_CH_32, SEL_ADC_0_CH_1_A0, SEL_ADC_0_CH_1_A1, SEL_ADC_0_CH_2_A0, SEL_ADC_0_CH_2_A1, SEL_ADC_0_CH_3_A0, SEL_ADC_0_CH_3_A1, SEL_ADC_0_CH_4_A0, SEL_ADC_0_CH_4_A1, SEL_ADC_0_CH_5_A0, SEL_ADC_0_CH_5_A1, SEL_ADC_0_CH_6_A0, SEL_ADC_0_CH_6_A1, SEL_ADC_0_CH_7_A0, SEL_ADC_0_CH_7_A1, SEL_ADC_0_CH_8_A0, SEL_ADC_0_CH_8_A1

### Nets
+3V3: C32.2 C33.2 C34.2 C35.2 C36.2 C37.2 C38.2 C39.2 DD3.6(VDD) DD4.6(VDD) DD5.6(VDD) DD6.6(VDD) DD7.6(VDD) DD8.6(VDD) DD9.6(VDD) DD10.6(VDD) R22.1 R23.1 R24.1 R25.1 R26.1 R27.1 R28.1 R29.1
GND: C32.1 C33.1 C34.1 C35.1 C36.1 C37.1 C38.1 C39.1 DD3.3(GND) DD4.3(GND) DD5.3(GND) DD6.3(GND) DD7.3(GND) DD8.3(GND) DD9.3(GND) DD10.3(GND)
NetB1_2: DD3.8(D) ; port ADC_0_CH_8
NetB1_4: DD8.8(D) ; port ADC_0_CH_7
NetB1_6: DD6.8(D) ; port ADC_0_CH_6
NetB1_8: DD7.8(D) ; port ADC_0_CH_5
NetB2_2: DD10.8(D) ; port ADC_1_CH_8
NetB2_6: DD9.8(D) ; port ADC_1_CH_6
NetB2_14: DD4.8(D) ; port ADC_1_CH_2
NetB2_16: DD5.8(D) ; port ADC_1_CH_1
NetC61_2: DD4.4(S3) ; port ECG_CH_1
NetC63_2: DD4.2(S1) ; port ECG_CH_2
NetC65_2: DD4.9(S2) ; port ECG_CH_3
NetC67_2: DD4.7(S4) ; port ECG_CH_4
NetC69_2: DD3.4(S3) ; port ECG_CH_5
NetC71_2: DD3.2(S1) ; port ECG_CH_6
NetC73_2: DD3.9(S2) ; port ECG_CH_7
NetC75_2: DD3.7(S4) ; port ECG_CH_8
NetC77_2: DD6.4(S3) ; port ECG_CH_9
NetC79_2: DD6.2(S1) ; port ECG_CH_10
NetC81_2: DD6.9(S2) ; port ECG_CH_11
NetC83_2: DD6.7(S4) ; port ECG_CH_12
NetC85_2: DD5.4(S3) ; port ECG_CH_13
NetC87_2: DD5.2(S1) ; port ECG_CH_14
NetC89_2: DD5.9(S2) ; port ECG_CH_15
NetC91_2: DD5.7(S4) ; port ECG_CH_16
NetC93_2: DD8.4(S3) ; port ECG_CH_17
NetC95_2: DD8.2(S1) ; port ECG_CH_18
NetC97_2: DD8.9(S2) ; port ECG_CH_19
NetC99_2: DD8.7(S4) ; port ECG_CH_20
NetC101_2: DD9.4(S3) ; port ECG_CH_31
NetC103_2: DD9.2(S1) ; port ECG_CH_32
NetC169_2: DD7.4(S3) ; port ECG_CH_21
NetC171_2: DD7.2(S1) ; port ECG_CH_22
NetC173_2: DD7.9(S2) ; port ECG_CH_23
NetC175_2: DD7.7(S4) ; port ECG_CH_24
NetC177_2: DD10.9(S2) ; port ECG_CH_25
NetC179_2: DD10.7(S4) ; port ECG_CH_26
NetC181_2: DD10.4(S3) ; port ECG_CH_27
NetC183_2: DD10.2(S1) ; port ECG_CH_28
NetC185_2: DD9.9(S2) ; port ECG_CH_29
NetC187_2: DD9.7(S4) ; port ECG_CH_30
NetDD1_34: DD10.1(A0) ; port SEL_ADC_0_CH_7_A0
NetDD1_35: DD10.10(A1) ; port SEL_ADC_0_CH_7_A1
NetDD1_39: DD9.1(A0) ; port SEL_ADC_0_CH_8_A0
NetDD1_40: DD9.10(A1) ; port SEL_ADC_0_CH_8_A1
NetDD1_47: DD5.10(A1) ; port SEL_ADC_0_CH_4_A1
NetDD1_53: DD5.1(A0) ; port SEL_ADC_0_CH_4_A0
NetDD1_54: DD4.1(A0) ; port SEL_ADC_0_CH_1_A0
NetDD1_55: DD4.10(A1) ; port SEL_ADC_0_CH_1_A1
NetDD1_56: DD8.1(A0) ; port SEL_ADC_0_CH_5_A0
NetDD1_57: DD8.10(A1) ; port SEL_ADC_0_CH_5_A1
NetDD1_58: DD3.1(A0) ; port SEL_ADC_0_CH_2_A0
NetDD1_59: DD3.10(A1) ; port SEL_ADC_0_CH_2_A1
NetDD1_60: DD7.1(A0) ; port SEL_ADC_0_CH_6_A0
NetDD1_61: DD7.10(A1) ; port SEL_ADC_0_CH_6_A1
NetDD1_62: DD6.1(A0) ; port SEL_ADC_0_CH_3_A0
NetDD1_63: DD6.10(A1) ; port SEL_ADC_0_CH_3_A1
NetDD3_5: DD3.5(EN) R22.2
NetDD4_5: DD4.5(EN) R23.2
NetDD5_5: DD5.5(EN) R24.2
NetDD6_5: DD6.5(EN) R25.2
NetDD7_5: DD7.5(EN) R26.2
NetDD8_5: DD8.5(EN) R27.2
NetDD9_5: DD9.5(EN) R28.2
NetDD10_5: DD10.5(EN) R29.2

### Notes on the sheet
- Перв. примен.
- Справ. №
- Подп. и дата
- Инв. № дубл.
- Взам. инв. №
- Разраб.
- Изм.
- Лист
- № докум.
- Подп.
- Дата
- Лит.
- Масса
- Масштаб
- Пров.
- Т.контр.
- Листов
- Инв. № подл.
- Согл.
- Утв.
- Н.контр.
- 2.106-A3
- Копировал
- Формат А3
- (in symbol MUX_ADG704BRMZ) MUX

### Library data of the parts
C32-C39 = CC_SMD_0603: Ceramic Capacitor SMD; Package: 0603; Value: 0.1uF
DD3-DD10 = MUX_ADG704BRMZ: 4-Channel Multiplexer; PartNumber: ADG704BRMZ; Package: MSOP-10
R22-R29 = R0603: Resistor SMD; Value: 10K

## Sheet ADC_1.SchDoc
size 420 x 297 mm; SheetNumber: 4; SheetTotal: 13
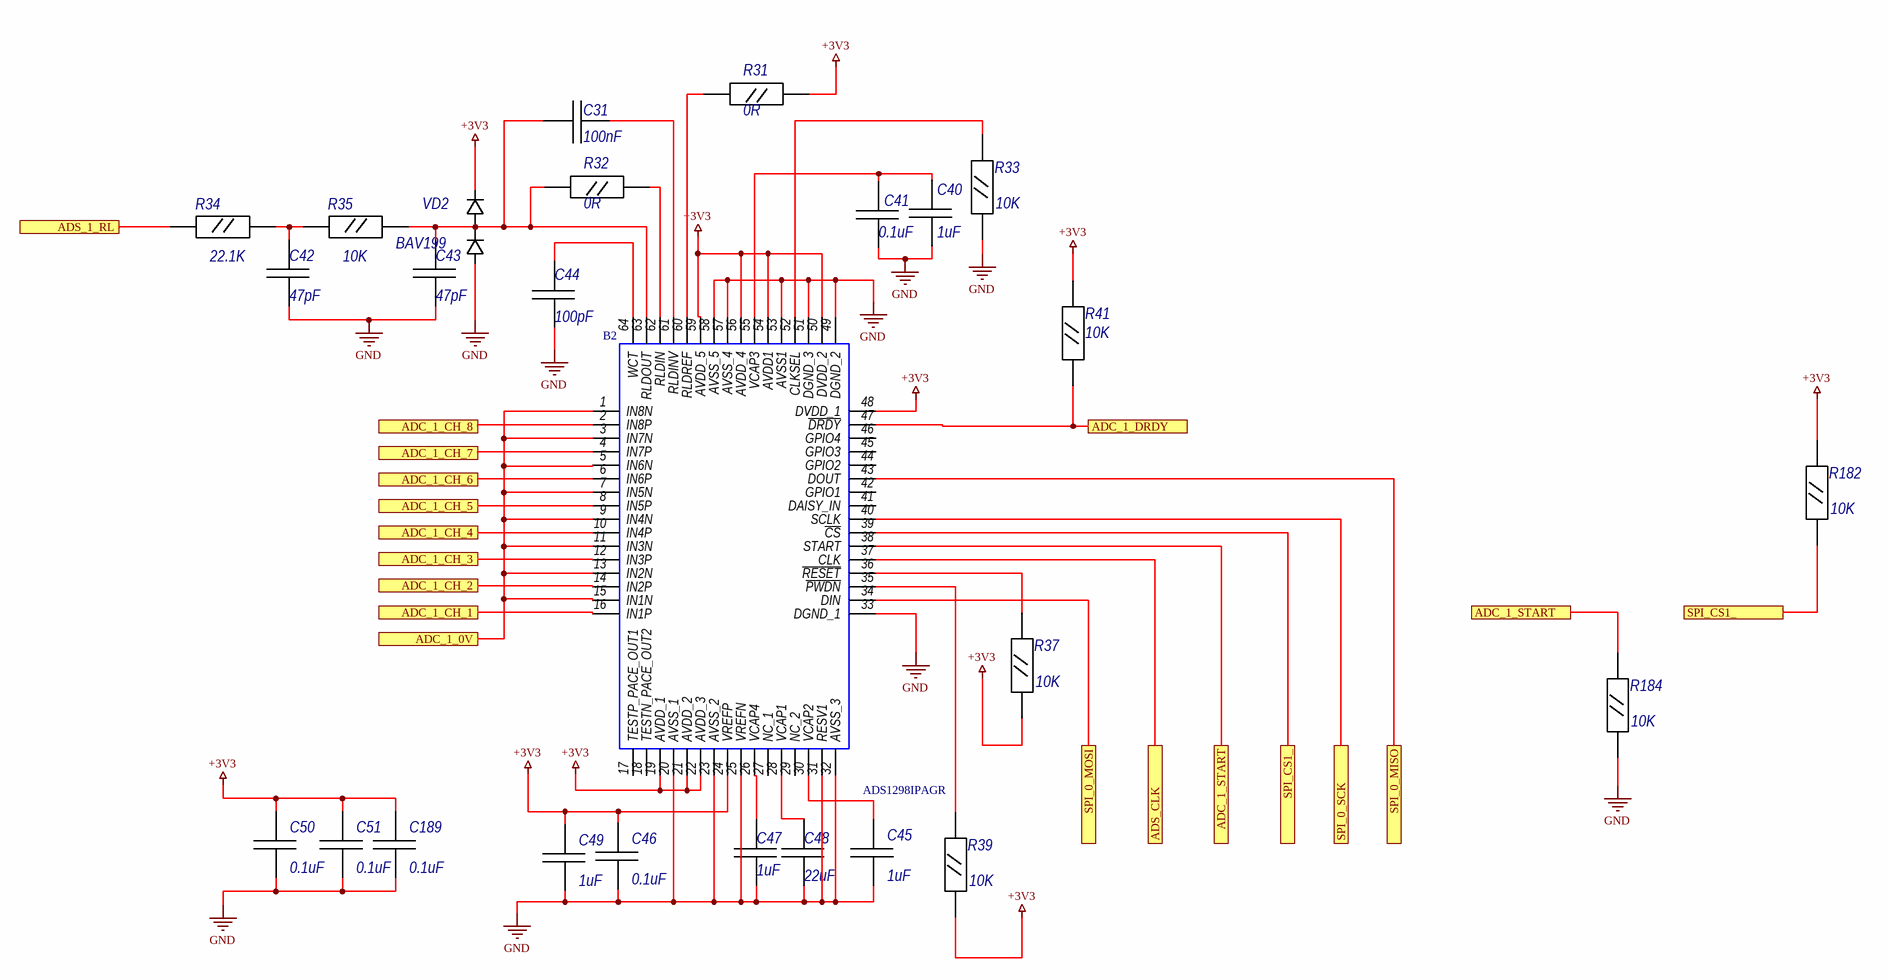
[diagram p3: ADC_1.SchDoc]

### Parts
B2  ADS1298IPAGR  [QFP50P1200X1200X120-64N]
C31  100nF  [C0603]
C40  1uF  [C0603]
C41  0.1uF  [C0603]
C42  47pF  [C0603]
C43  47pF  [C0603]
C44  100pF  [C0603]
C45  1uF  [C0603]
C46  0.1uF  [C0603]
C47  1uF  [C0603]
C48  22uF  [C0603]
C49  1uF  [C0603]
C50  0.1uF  [C0603]
C51  0.1uF  [C0603]
C189  0.1uF  [C0603]
R31  0R  [R0603]
R32  0R  [R0603]
R33  10K  [R0603]
R34  22.1K  [R0603]
R35  10K  [R0603]
R37  10K  [R0603]
R39  10K  [R0603]
R41  10K  [R0603]
R182  10K  [R0603]
R184  10K  [R0603]
VD2  BAV199  [SOT23]

### Ports
ADC_1_0V, ADC_1_CH_1, ADC_1_CH_2, ADC_1_CH_3, ADC_1_CH_4, ADC_1_CH_5, ADC_1_CH_6, ADC_1_CH_7, ADC_1_CH_8, ADC_1_DRDY, ADC_1_START, ADS_1_RL, ADS_CLK, SPI_0_MISO, SPI_0_MOSI, SPI_0_SCK, SPI_CS1_

### Nets
+3V3: B2.19(AVDD_1) B2.21(AVDD_2) B2.22(AVDD_3) B2.24(VREFP) B2.48(DVDD_1) B2.50(DVDD_2) B2.54(AVDD1) B2.56(AVDD_4) B2.59(AVDD_5) C46.2 C49.2 C50.2 C51.2 C189.2 R31.1 R37.1 R39.1 R41.2 R182.2 VD2.2
GND: B2.20(AVSS_1) B2.23(AVSS_2) B2.25(VREFN) B2.31(RESV1) B2.32(AVSS_3) B2.33(DGND_1) B2.49(DGND_2) B2.51(DGND_3) B2.53(AVSS1) B2.57(AVSS_4) B2.58(AVSS_5) C40.1 C41.1 C42.1 C43.1 C44.1 C45.1 C46.1 C47.1 C48.1 C49.1 C50.1 C51.1 C189.1 R33.1 R184.1 VD2.1
NetB1_34: B2.34(DIN) ; port SPI_0_MOSI
NetB1_37: B2.37(CLK) ; port ADS_CLK
NetB1_40: B2.40(SCLK) ; port SPI_0_SCK
NetB1_43: B2.43(DOUT) ; port SPI_0_MISO
NetB2_1: B2.1(IN8N) B2.3(IN7N) B2.5(IN6N) B2.7(IN5N) B2.9(IN4N) B2.11(IN3N) B2.13(IN2N) B2.15(IN1N) ; port ADC_1_0V
NetB2_2: B2.2(IN8P) ; port ADC_1_CH_8
NetB2_4: B2.4(IN7P) ; port ADC_1_CH_7
NetB2_6: B2.6(IN6P) ; port ADC_1_CH_6
NetB2_8: B2.8(IN5P) ; port ADC_1_CH_5
NetB2_10: B2.10(IN4P) ; port ADC_1_CH_4
NetB2_12: B2.12(IN3P) ; port ADC_1_CH_3
NetB2_14: B2.14(IN2P) ; port ADC_1_CH_2
NetB2_16: B2.16(IN1P) ; port ADC_1_CH_1
NetB2_26: B2.26(VCAP4) C47.2
NetB2_28: B2.28(VCAP1) C48.2
NetB2_30: B2.30(VCAP2) C45.2
NetB2_35: B2.35(~{PWDN}) R39.2
NetB2_36: B2.36(~{RESET}) R37.2
NetB2_38: B2.38(START) R184.2 ; port ADC_1_START
NetB2_39: B2.39(~{CS}) R182.1 ; port SPI_CS1_
NetB2_47: B2.47(~{DRDY}) R41.1 ; port ADC_1_DRDY
NetB2_52: B2.52(CLKSEL) R33.2
NetB2_55: B2.55(VCAP3) C40.2 C41.2
NetB2_60: B2.60(RLDREF) R31.2
NetB2_61: B2.61(RLDINV) C31.1
NetB2_62: B2.62(RLDIN) R32.1
NetB2_63: B2.63(RLDOUT) C31.2 C43.2 R32.2 R35.2 VD2.3
NetB2_64: B2.64(WCT) C44.2
NetC42_2: C42.2 R34.2 R35.1
NetR34_1: R34.1 ; port ADS_1_RL

Not connected (* = marked no-connect by the designer): B2 17(TESTP_PACE_OUT1) 18(TESTN_PACE_OUT2) 27(NC_1) 29(NC_2) 41(DAISY_IN) 42(GPIO1) 44(GPIO2) 45(GPIO3) 46(GPIO4)

### Notes on the sheet
- Перв. примен.
- Справ. №
- Подп. и дата
- Инв. № дубл.
- Взам. инв. №
- Разраб.
- Изм.
- Лист
- № докум.
- Подп.
- Дата
- Лит.
- Масса
- Масштаб
- Пров.
- Т.контр.
- Листов
- Инв. № подл.
- Утв.
- Н.контр.
- 2.106-A3
- Копировал
- Формат А3

### Library data of the parts
B2 = ADS1298IPAGR: as B1 on sheet ADC_0; Mouser Part Number: 595-ADS1298IPAGR; Mouser Price/Stock: https://www.mouser.co.uk/ProductDetail/Texas-Instruments/ADS1298IPAGR?qs=Z6FgPJT5dDSzK7JhuKfPmw%3D%3D; Manufacturer_Part_Number: ADS1298IPAGR; Datasheet Link: http://www.ti.com/lit/ds/symlink/ads1294.pdf
C31 C40-C51 C189 = CC_SMD_0603: Ceramic Capacitor SMD; Package: 0603
  C31: Value: 100nF
  C40 C45 C47 C49: Value: 1uF
  C41 C46 C50 C51 C189: Value: 0.1uF
  C42 C43: Value: 47pF
  C44: Value: 100pF
  C48: Value: 22uF
R31-R35 R37 R39 R41 R182 R184 = R0603: Resistor SMD
  R31 R32: Value: 0R
  R33 R35 R37 R39 R41 R182 R184: Value: 10K
  R34: Value: 22.1K
VD2 = DIODE_BAV199: Diod Schottky; Diode Type: Standard; Package: SOT-23; PartNumber: BAV199; Manufacturer Part Number 1: BAV199

## Sheet ADC_1_MUL.SchDoc
size 420 x 297 mm; SheetNumber: 5; SheetTotal: 13
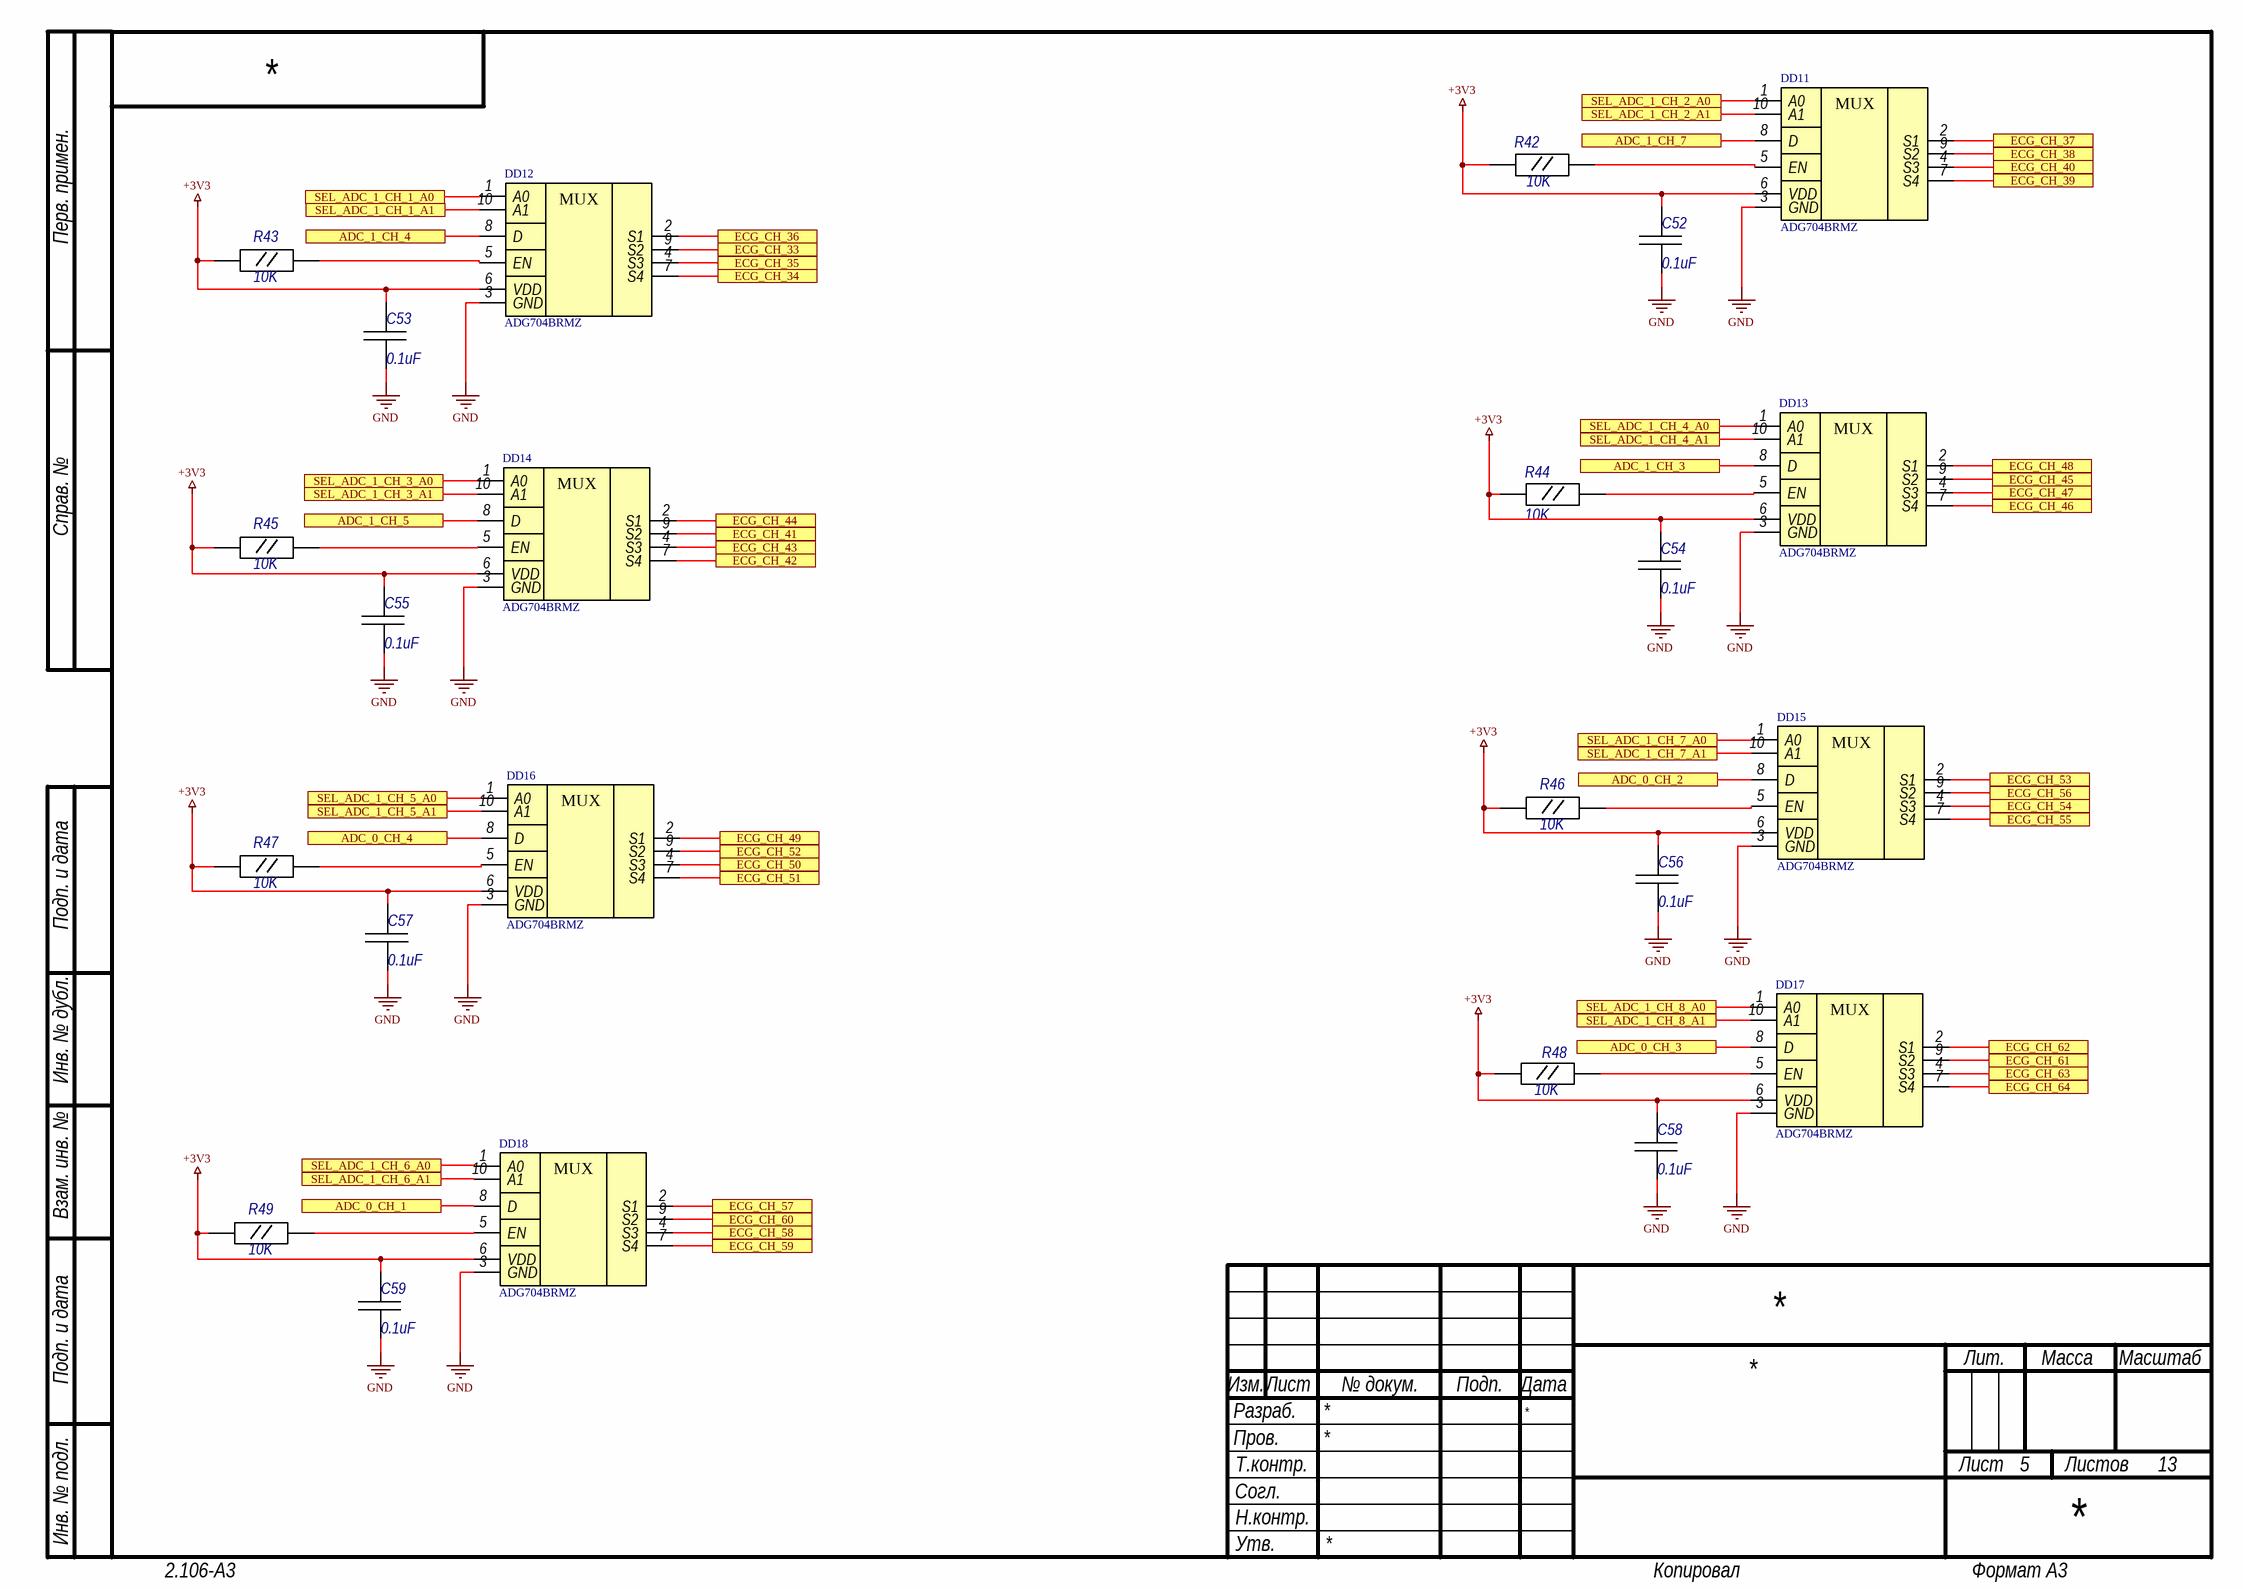
[diagram p4: ADC_1_MUL.SchDoc]

### Parts
C52  0.1uF  [C0603]
C53  0.1uF  [C0603]
C54  0.1uF  [C0603]
C55  0.1uF  [C0603]
C56  0.1uF  [C0603]
C57  0.1uF  [C0603]
C58  0.1uF  [C0603]
C59  0.1uF  [C0603]
DD11  ADG704BRMZ  [MSOP-10]
DD12  ADG704BRMZ  [MSOP-10]
DD13  ADG704BRMZ  [MSOP-10]
DD14  ADG704BRMZ  [MSOP-10]
DD15  ADG704BRMZ  [MSOP-10]
DD16  ADG704BRMZ  [MSOP-10]
DD17  ADG704BRMZ  [MSOP-10]
DD18  ADG704BRMZ  [MSOP-10]
R42  10K  [R0603]
R43  10K  [R0603]
R44  10K  [R0603]
R45  10K  [R0603]
R46  10K  [R0603]
R47  10K  [R0603]
R48  10K  [R0603]
R49  10K  [R0603]

### Ports
ADC_0_CH_1, ADC_0_CH_2, ADC_0_CH_3, ADC_0_CH_4, ADC_1_CH_3, ADC_1_CH_4, ADC_1_CH_5, ADC_1_CH_7, ECG_CH_33, ECG_CH_34, ECG_CH_35, ECG_CH_36, ECG_CH_37, ECG_CH_38, ECG_CH_39, ECG_CH_40, ECG_CH_41, ECG_CH_42, ECG_CH_43, ECG_CH_44, ECG_CH_45, ECG_CH_46, ECG_CH_47, ECG_CH_48, ECG_CH_49, ECG_CH_50, ECG_CH_51, ECG_CH_52, ECG_CH_53, ECG_CH_54, ECG_CH_55, ECG_CH_56, ECG_CH_57, ECG_CH_58, ECG_CH_59, ECG_CH_60, ECG_CH_61, ECG_CH_62, ECG_CH_63, ECG_CH_64, SEL_ADC_1_CH_1_A0, SEL_ADC_1_CH_1_A1, SEL_ADC_1_CH_2_A0, SEL_ADC_1_CH_2_A1, SEL_ADC_1_CH_3_A0, SEL_ADC_1_CH_3_A1, SEL_ADC_1_CH_4_A0, SEL_ADC_1_CH_4_A1, SEL_ADC_1_CH_5_A0, SEL_ADC_1_CH_5_A1, SEL_ADC_1_CH_6_A0, SEL_ADC_1_CH_6_A1, SEL_ADC_1_CH_7_A0, SEL_ADC_1_CH_7_A1, SEL_ADC_1_CH_8_A0, SEL_ADC_1_CH_8_A1

### Nets
+3V3: C52.2 C53.2 C54.2 C55.2 C56.2 C57.2 C58.2 C59.2 DD11.6(VDD) DD12.6(VDD) DD13.6(VDD) DD14.6(VDD) DD15.6(VDD) DD16.6(VDD) DD17.6(VDD) DD18.6(VDD) R42.1 R43.1 R44.1 R45.1 R46.1 R47.1 R48.1 R49.1
GND: C52.1 C53.1 C54.1 C55.1 C56.1 C57.1 C58.1 C59.1 DD11.3(GND) DD12.3(GND) DD13.3(GND) DD14.3(GND) DD15.3(GND) DD16.3(GND) DD17.3(GND) DD18.3(GND)
NetB1_10: DD16.8(D) ; port ADC_0_CH_4
NetB1_12: DD17.8(D) ; port ADC_0_CH_3
NetB1_14: DD15.8(D) ; port ADC_0_CH_2
NetB1_16: DD18.8(D) ; port ADC_0_CH_1
NetB2_4: DD11.8(D) ; port ADC_1_CH_7
NetB2_8: DD14.8(D) ; port ADC_1_CH_5
NetB2_10: DD12.8(D) ; port ADC_1_CH_4
NetB2_12: DD13.8(D) ; port ADC_1_CH_3
NetC105_2: DD12.9(S2) ; port ECG_CH_33
NetC107_2: DD12.7(S4) ; port ECG_CH_34
NetC109_2: DD12.4(S3) ; port ECG_CH_35
NetC111_2: DD12.2(S1) ; port ECG_CH_36
NetC113_2: DD11.2(S1) ; port ECG_CH_37
NetC115_2: DD11.9(S2) ; port ECG_CH_38
NetC117_2: DD11.7(S4) ; port ECG_CH_39
NetC119_2: DD11.4(S3) ; port ECG_CH_40
NetC121_2: DD14.9(S2) ; port ECG_CH_41
NetC123_2: DD14.7(S4) ; port ECG_CH_42
NetC125_2: DD14.4(S3) ; port ECG_CH_43
NetC127_2: DD14.2(S1) ; port ECG_CH_44
NetC129_2: DD13.9(S2) ; port ECG_CH_45
NetC131_2: DD13.7(S4) ; port ECG_CH_46
NetC133_2: DD13.4(S3) ; port ECG_CH_47
NetC135_2: DD13.2(S1) ; port ECG_CH_48
NetC137_2: DD16.2(S1) ; port ECG_CH_49
NetC139_2: DD16.4(S3) ; port ECG_CH_50
NetC141_2: DD16.7(S4) ; port ECG_CH_51
NetC143_2: DD16.9(S2) ; port ECG_CH_52
NetC145_2: DD15.2(S1) ; port ECG_CH_53
NetC147_2: DD15.4(S3) ; port ECG_CH_54
NetC149_2: DD15.7(S4) ; port ECG_CH_55
NetC151_2: DD15.9(S2) ; port ECG_CH_56
NetC153_2: DD18.2(S1) ; port ECG_CH_57
NetC155_2: DD18.4(S3) ; port ECG_CH_58
NetC157_2: DD18.7(S4) ; port ECG_CH_59
NetC159_2: DD18.9(S2) ; port ECG_CH_60
NetC161_2: DD17.9(S2) ; port ECG_CH_61
NetC163_2: DD17.2(S1) ; port ECG_CH_62
NetC165_2: DD17.4(S3) ; port ECG_CH_63
NetC167_2: DD17.7(S4) ; port ECG_CH_64
NetDD1_36: DD11.1(A0) ; port SEL_ADC_1_CH_2_A0
NetDD1_38: DD11.10(A1) ; port SEL_ADC_1_CH_2_A1
NetDD1_41: DD14.1(A0) ; port SEL_ADC_1_CH_3_A0
NetDD1_42: DD14.10(A1) ; port SEL_ADC_1_CH_3_A1
NetDD1_43: DD12.1(A0) ; port SEL_ADC_1_CH_1_A0
NetDD1_44: DD12.10(A1) ; port SEL_ADC_1_CH_1_A1
NetDD1_45: DD13.1(A0) ; port SEL_ADC_1_CH_4_A0
NetDD1_46: DD13.10(A1) ; port SEL_ADC_1_CH_4_A1
NetDD1_64: DD16.1(A0) ; port SEL_ADC_1_CH_5_A0
NetDD1_65: DD16.10(A1) ; port SEL_ADC_1_CH_5_A1
NetDD1_66: DD17.1(A0) ; port SEL_ADC_1_CH_8_A0
NetDD1_67: DD17.10(A1) ; port SEL_ADC_1_CH_8_A1
NetDD1_68: DD15.1(A0) ; port SEL_ADC_1_CH_7_A0
NetDD1_69: DD15.10(A1) ; port SEL_ADC_1_CH_7_A1
NetDD1_70: DD18.1(A0) ; port SEL_ADC_1_CH_6_A0
NetDD1_71: DD18.10(A1) ; port SEL_ADC_1_CH_6_A1
NetDD11_5: DD11.5(EN) R42.2
NetDD12_5: DD12.5(EN) R43.2
NetDD13_5: DD13.5(EN) R44.2
NetDD14_5: DD14.5(EN) R45.2
NetDD15_5: DD15.5(EN) R46.2
NetDD16_5: DD16.5(EN) R47.2
NetDD17_5: DD17.5(EN) R48.2
NetDD18_5: DD18.5(EN) R49.2

### Notes on the sheet
- Перв. примен.
- Справ. №
- Подп. и дата
- Инв. № дубл.
- Взам. инв. №
- Разраб.
- Изм.
- Лист
- № докум.
- Подп.
- Дата
- Лит.
- Масса
- Масштаб
- Пров.
- Т.контр.
- Листов
- Инв. № подл.
- Согл.
- Утв.
- Н.контр.
- 2.106-A3
- Копировал
- Формат А3
- (in symbol MUX_ADG704BRMZ) MUX

### Library data of the parts
C52-C59 = CC_SMD_0603: Ceramic Capacitor SMD; Package: 0603; Value: 0.1uF
DD11-DD18 = MUX_ADG704BRMZ: 4-Channel Multiplexer; PartNumber: ADG704BRMZ; Package: MSOP-10
R42-R49 = R0603: Resistor SMD; Value: 10K

## Sheet Filter1.SchDoc
size 420 x 297 mm; SheetNumber: 6; SheetTotal: 13
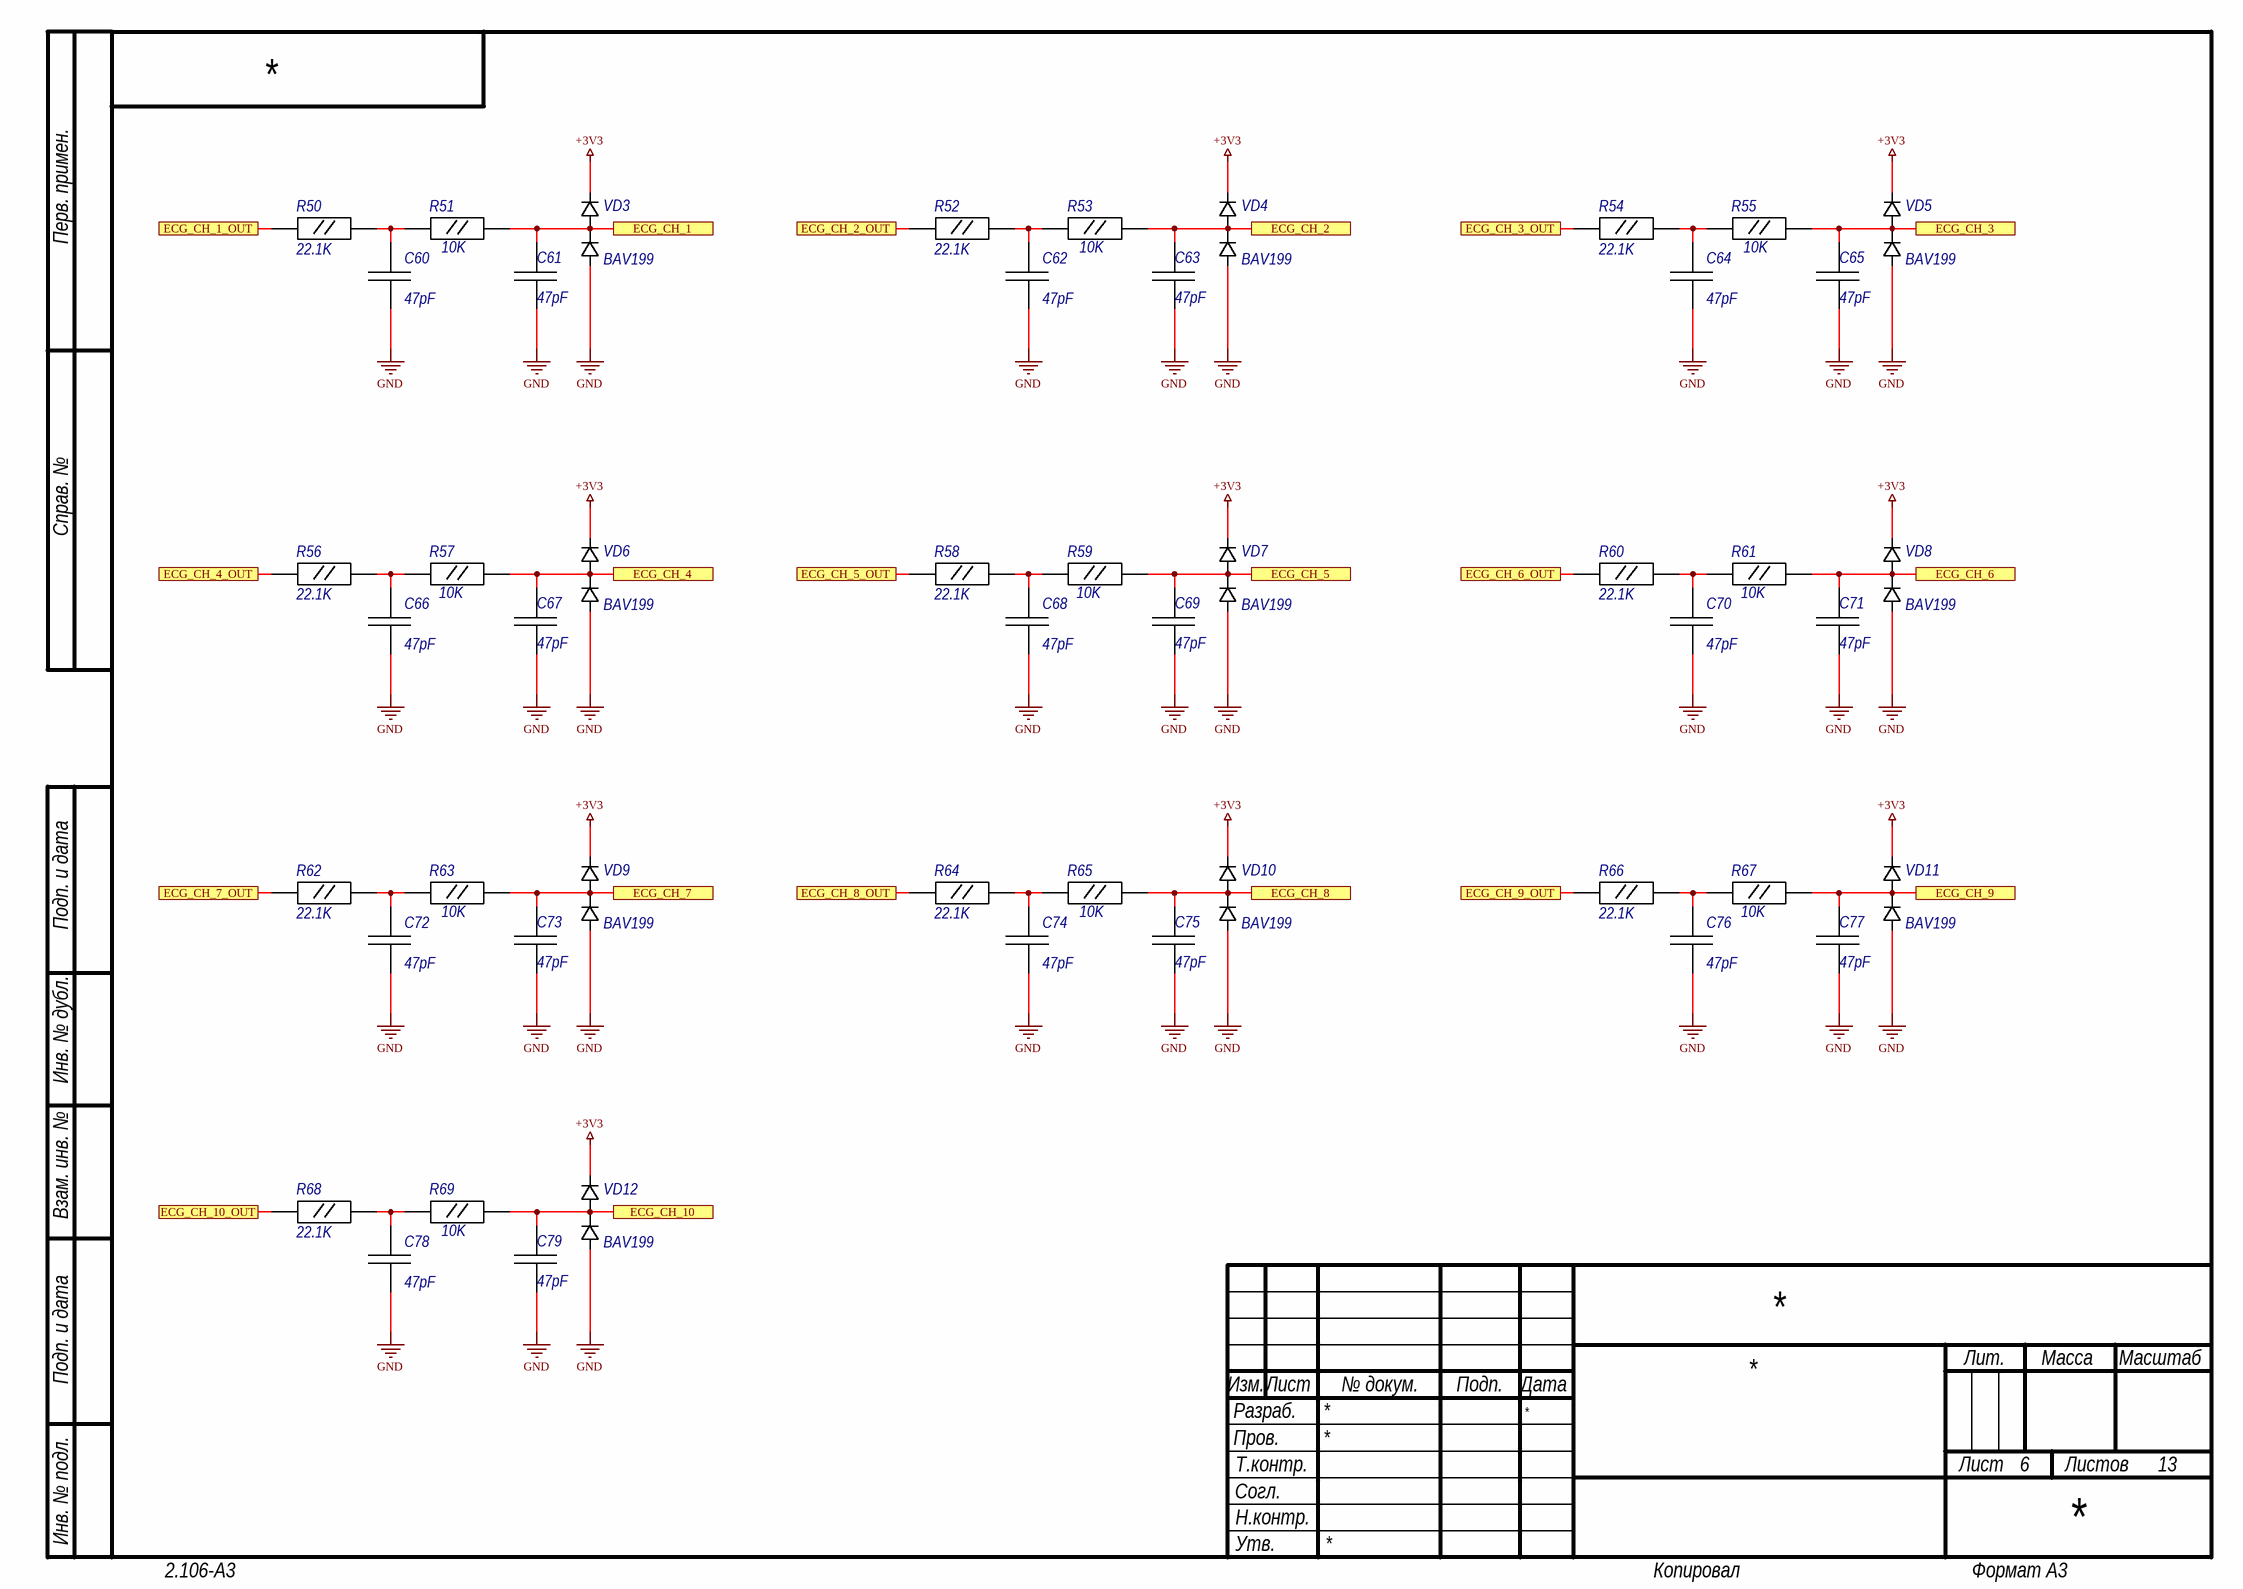
[diagram p5: Filter1.SchDoc]

### Parts
C60  47pF  [C0603]
C61  47pF  [C0603]
C62  47pF  [C0603]
C63  47pF  [C0603]
C64  47pF  [C0603]
C65  47pF  [C0603]
C66  47pF  [C0603]
C67  47pF  [C0603]
C68  47pF  [C0603]
C69  47pF  [C0603]
C70  47pF  [C0603]
C71  47pF  [C0603]
C72  47pF  [C0603]
C73  47pF  [C0603]
C74  47pF  [C0603]
C75  47pF  [C0603]
C76  47pF  [C0603]
C77  47pF  [C0603]
C78  47pF  [C0603]
C79  47pF  [C0603]
R50  22.1K  [R0603]
R51  10K  [R0603]
R52  22.1K  [R0603]
R53  10K  [R0603]
R54  22.1K  [R0603]
R55  10K  [R0603]
R56  22.1K  [R0603]
R57  10K  [R0603]
R58  22.1K  [R0603]
R59  10K  [R0603]
R60  22.1K  [R0603]
R61  10K  [R0603]
R62  22.1K  [R0603]
R63  10K  [R0603]
R64  22.1K  [R0603]
R65  10K  [R0603]
R66  22.1K  [R0603]
R67  10K  [R0603]
R68  22.1K  [R0603]
R69  10K  [R0603]
VD3  BAV199  [SOT23]
VD4  BAV199  [SOT23]
VD5  BAV199  [SOT23]
VD6  BAV199  [SOT23]
VD7  BAV199  [SOT23]
VD8  BAV199  [SOT23]
VD9  BAV199  [SOT23]
VD10  BAV199  [SOT23]
VD11  BAV199  [SOT23]
VD12  BAV199  [SOT23]

### Ports
ECG_CH_1, ECG_CH_1_OUT, ECG_CH_2, ECG_CH_2_OUT, ECG_CH_3, ECG_CH_3_OUT, ECG_CH_4, ECG_CH_4_OUT, ECG_CH_5, ECG_CH_5_OUT, ECG_CH_6, ECG_CH_6_OUT, ECG_CH_7, ECG_CH_7_OUT, ECG_CH_8, ECG_CH_8_OUT, ECG_CH_9, ECG_CH_9_OUT, ECG_CH_10, ECG_CH_10_OUT

### Nets
+3V3: VD3.2 VD4.2 VD5.2 VD6.2 VD7.2 VD8.2 VD9.2 VD10.2 VD11.2 VD12.2
GND: C60.1 C61.1 C62.1 C63.1 C64.1 C65.1 C66.1 C67.1 C68.1 C69.1 C70.1 C71.1 C72.1 C73.1 C74.1 C75.1 C76.1 C77.1 C78.1 C79.1 VD3.1 VD4.1 VD5.1 VD6.1 VD7.1 VD8.1 VD9.1 VD10.1 VD11.1 VD12.1
NetC60_2: C60.2 R50.2 R51.1
NetC61_2: C61.2 R51.2 VD3.3 ; port ECG_CH_1
NetC62_2: C62.2 R52.2 R53.1
NetC63_2: C63.2 R53.2 VD4.3 ; port ECG_CH_2
NetC64_2: C64.2 R54.2 R55.1
NetC65_2: C65.2 R55.2 VD5.3 ; port ECG_CH_3
NetC66_2: C66.2 R56.2 R57.1
NetC67_2: C67.2 R57.2 VD6.3 ; port ECG_CH_4
NetC68_2: C68.2 R58.2 R59.1
NetC69_2: C69.2 R59.2 VD7.3 ; port ECG_CH_5
NetC70_2: C70.2 R60.2 R61.1
NetC71_2: C71.2 R61.2 VD8.3 ; port ECG_CH_6
NetC72_2: C72.2 R62.2 R63.1
NetC73_2: C73.2 R63.2 VD9.3 ; port ECG_CH_7
NetC74_2: C74.2 R64.2 R65.1
NetC75_2: C75.2 R65.2 VD10.3 ; port ECG_CH_8
NetC76_2: C76.2 R66.2 R67.1
NetC77_2: C77.2 R67.2 VD11.3 ; port ECG_CH_9
NetC78_2: C78.2 R68.2 R69.1
NetC79_2: C79.2 R69.2 VD12.3 ; port ECG_CH_10
NetR50_1: R50.1 ; port ECG_CH_1_OUT
NetR52_1: R52.1 ; port ECG_CH_2_OUT
NetR54_1: R54.1 ; port ECG_CH_3_OUT
NetR56_1: R56.1 ; port ECG_CH_4_OUT
NetR58_1: R58.1 ; port ECG_CH_5_OUT
NetR60_1: R60.1 ; port ECG_CH_6_OUT
NetR62_1: R62.1 ; port ECG_CH_7_OUT
NetR64_1: R64.1 ; port ECG_CH_8_OUT
NetR66_1: R66.1 ; port ECG_CH_9_OUT
NetR68_1: R68.1 ; port ECG_CH_10_OUT

### Notes on the sheet
- Перв. примен.
- Справ. №
- Подп. и дата
- Инв. № дубл.
- Взам. инв. №
- Разраб.
- Изм.
- Лист
- № докум.
- Подп.
- Дата
- Лит.
- Масса
- Масштаб
- Пров.
- Т.контр.
- Листов
- Инв. № подл.
- Согл.
- Утв.
- Н.контр.
- 2.106-A3
- Копировал
- Формат А3

### Library data of the parts
C60-C79 = CC_SMD_0603: Ceramic Capacitor SMD; Package: 0603; Value: 47pF
R50-R69 = R0603: Resistor SMD
  R50 R52 R54 R56 R58 R60 R62 R64 R66 R68: Value: 22.1K
  R51 R53 R55 R57 R59 R61 R63 R65 R67 R69: Value: 10K
VD3-VD12 = DIODE_BAV199: Diod Schottky; Diode Type: Standard; Package: SOT-23; PartNumber: BAV199; Manufacturer Part Number 1: BAV199

## Sheet Filter2.SchDoc
size 420 x 297 mm; SheetNumber: 7; SheetTotal: 13
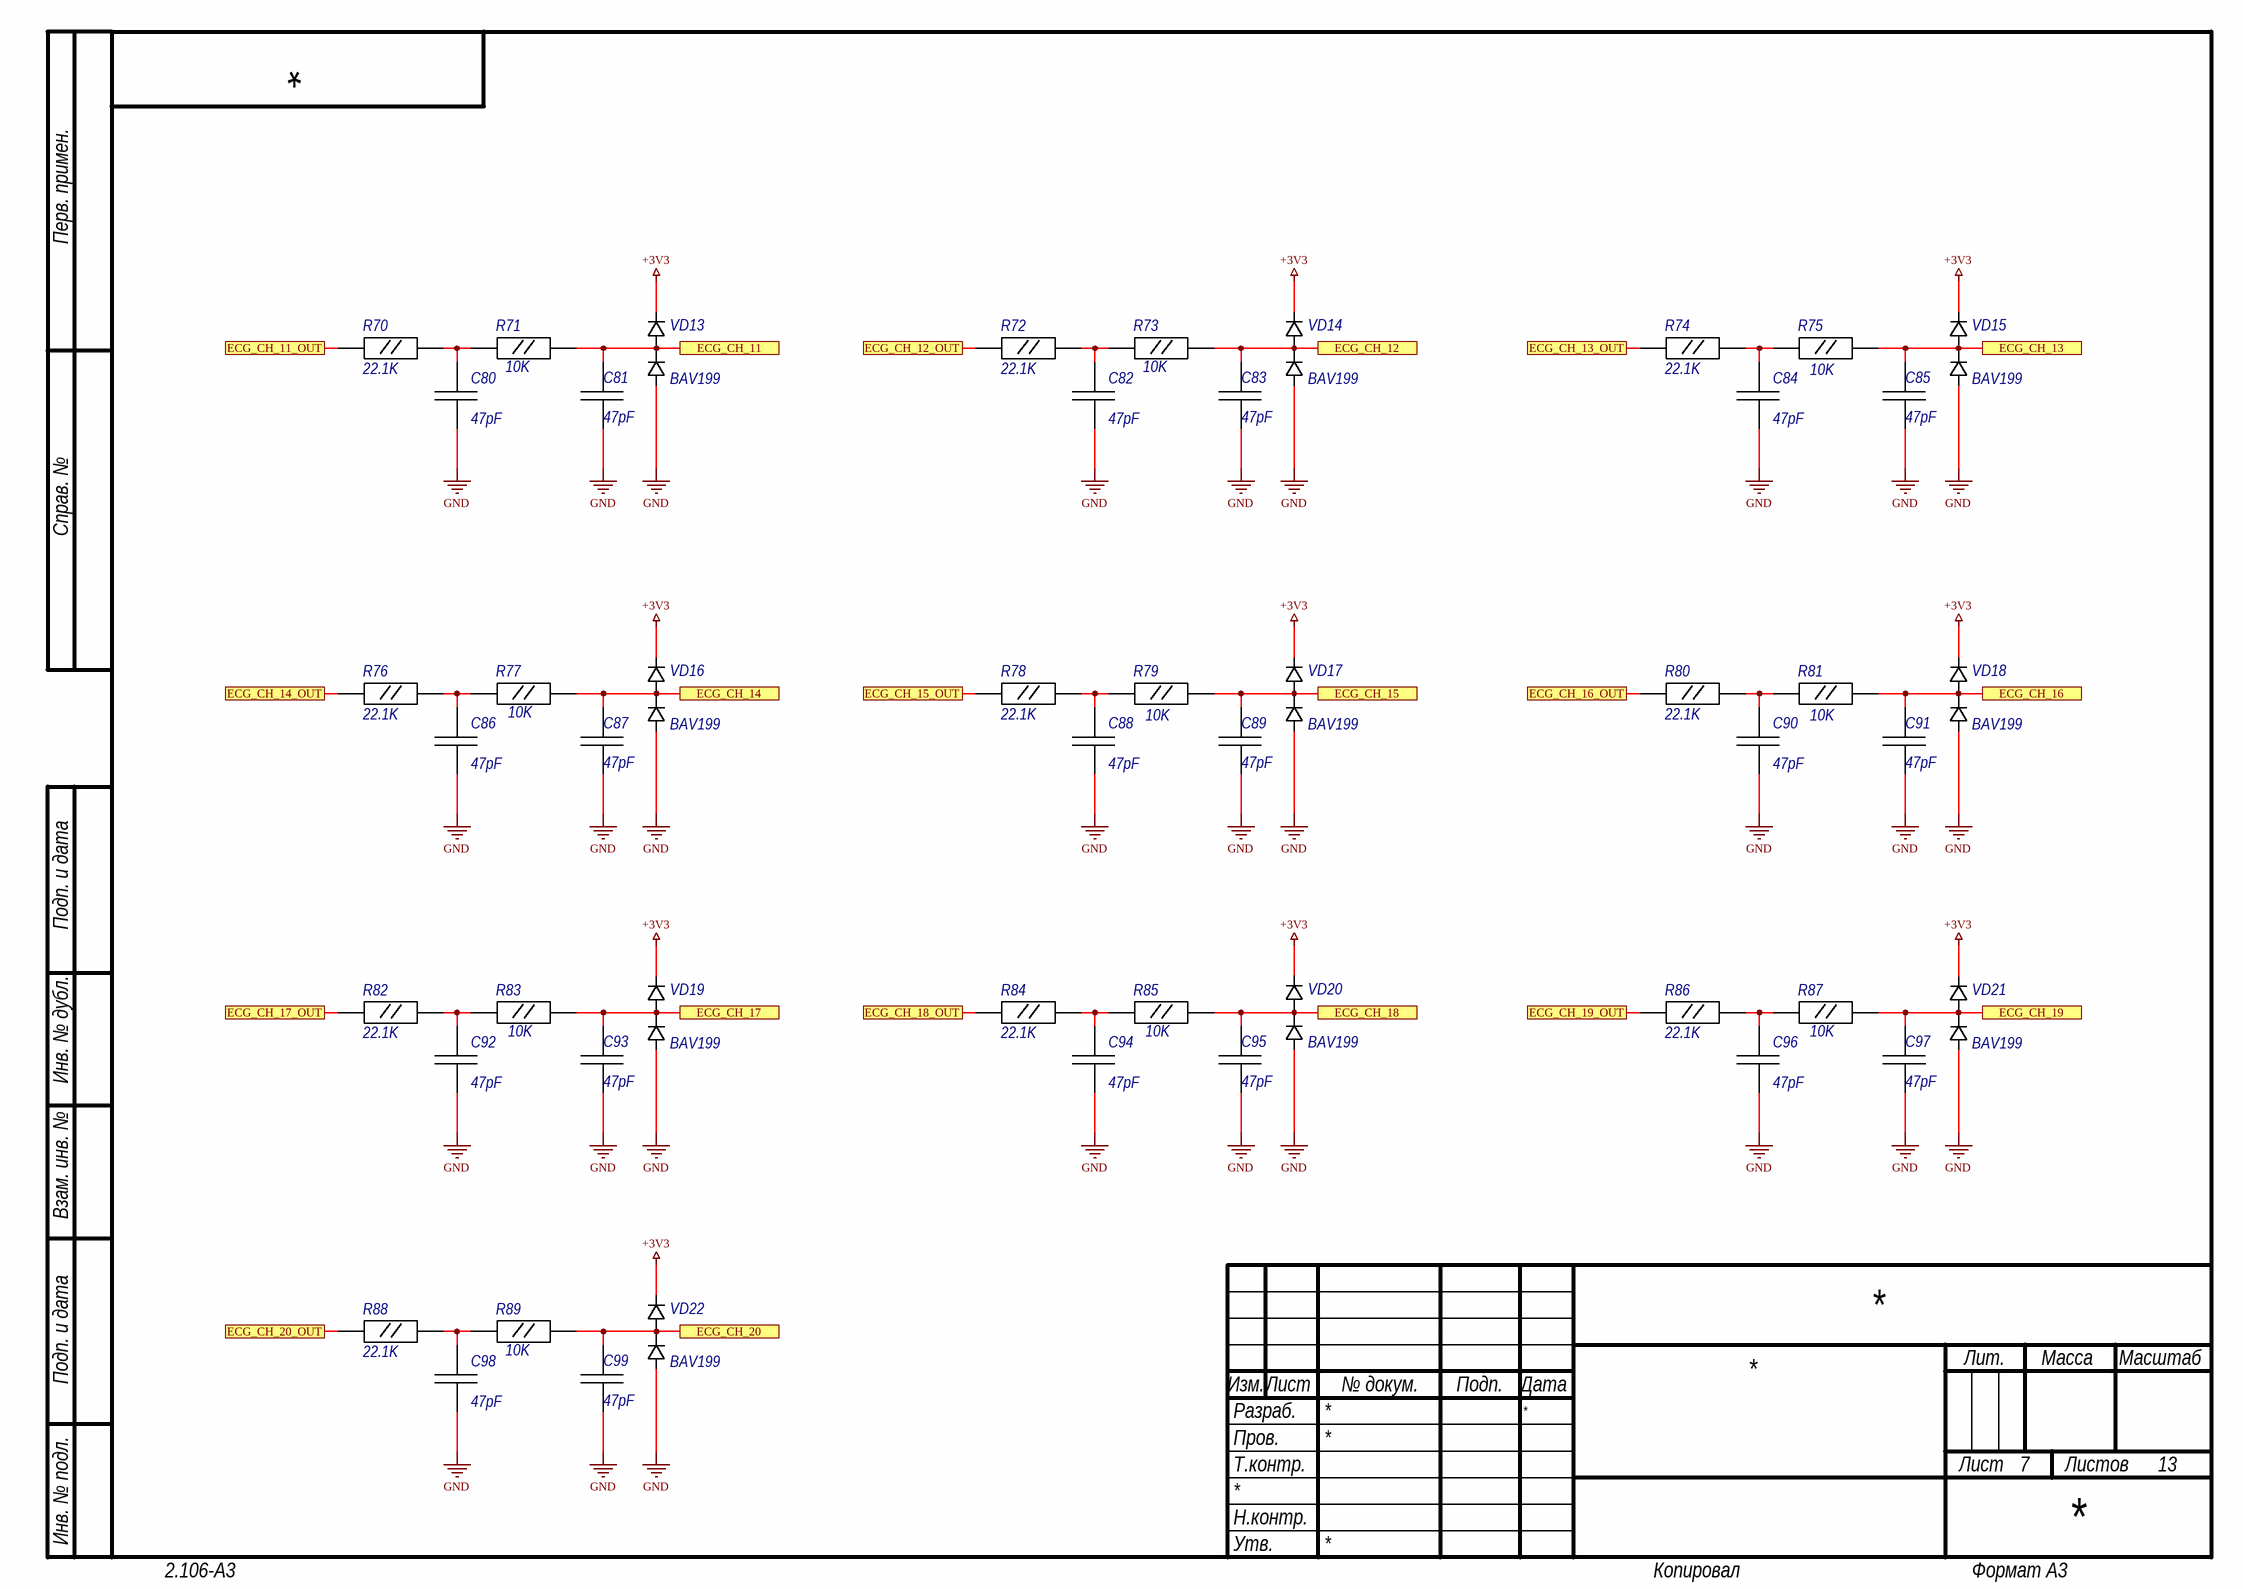
[diagram p6: Filter2.SchDoc]

### Parts
C80  47pF  [C0603]
C81  47pF  [C0603]
C82  47pF  [C0603]
C83  47pF  [C0603]
C84  47pF  [C0603]
C85  47pF  [C0603]
C86  47pF  [C0603]
C87  47pF  [C0603]
C88  47pF  [C0603]
C89  47pF  [C0603]
C90  47pF  [C0603]
C91  47pF  [C0603]
C92  47pF  [C0603]
C93  47pF  [C0603]
C94  47pF  [C0603]
C95  47pF  [C0603]
C96  47pF  [C0603]
C97  47pF  [C0603]
C98  47pF  [C0603]
C99  47pF  [C0603]
R70  22.1K  [R0603]
R71  10K  [R0603]
R72  22.1K  [R0603]
R73  10K  [R0603]
R74  22.1K  [R0603]
R75  10K  [R0603]
R76  22.1K  [R0603]
R77  10K  [R0603]
R78  22.1K  [R0603]
R79  10K  [R0603]
R80  22.1K  [R0603]
R81  10K  [R0603]
R82  22.1K  [R0603]
R83  10K  [R0603]
R84  22.1K  [R0603]
R85  10K  [R0603]
R86  22.1K  [R0603]
R87  10K  [R0603]
R88  22.1K  [R0603]
R89  10K  [R0603]
VD13  BAV199  [SOT23]
VD14  BAV199  [SOT23]
VD15  BAV199  [SOT23]
VD16  BAV199  [SOT23]
VD17  BAV199  [SOT23]
VD18  BAV199  [SOT23]
VD19  BAV199  [SOT23]
VD20  BAV199  [SOT23]
VD21  BAV199  [SOT23]
VD22  BAV199  [SOT23]

### Ports
ECG_CH_11, ECG_CH_11_OUT, ECG_CH_12, ECG_CH_12_OUT, ECG_CH_13, ECG_CH_13_OUT, ECG_CH_14, ECG_CH_14_OUT, ECG_CH_15, ECG_CH_15_OUT, ECG_CH_16, ECG_CH_16_OUT, ECG_CH_17, ECG_CH_17_OUT, ECG_CH_18, ECG_CH_18_OUT, ECG_CH_19, ECG_CH_19_OUT, ECG_CH_20, ECG_CH_20_OUT

### Nets
+3V3: VD13.2 VD14.2 VD15.2 VD16.2 VD17.2 VD18.2 VD19.2 VD20.2 VD21.2 VD22.2
GND: C80.1 C81.1 C82.1 C83.1 C84.1 C85.1 C86.1 C87.1 C88.1 C89.1 C90.1 C91.1 C92.1 C93.1 C94.1 C95.1 C96.1 C97.1 C98.1 C99.1 VD13.1 VD14.1 VD15.1 VD16.1 VD17.1 VD18.1 VD19.1 VD20.1 VD21.1 VD22.1
NetC80_2: C80.2 R70.2 R71.1
NetC81_2: C81.2 R71.2 VD13.3 ; port ECG_CH_11
NetC82_2: C82.2 R72.2 R73.1
NetC83_2: C83.2 R73.2 VD14.3 ; port ECG_CH_12
NetC84_2: C84.2 R74.2 R75.1
NetC85_2: C85.2 R75.2 VD15.3 ; port ECG_CH_13
NetC86_2: C86.2 R76.2 R77.1
NetC87_2: C87.2 R77.2 VD16.3 ; port ECG_CH_14
NetC88_2: C88.2 R78.2 R79.1
NetC89_2: C89.2 R79.2 VD17.3 ; port ECG_CH_15
NetC90_2: C90.2 R80.2 R81.1
NetC91_2: C91.2 R81.2 VD18.3 ; port ECG_CH_16
NetC92_2: C92.2 R82.2 R83.1
NetC93_2: C93.2 R83.2 VD19.3 ; port ECG_CH_17
NetC94_2: C94.2 R84.2 R85.1
NetC95_2: C95.2 R85.2 VD20.3 ; port ECG_CH_18
NetC96_2: C96.2 R86.2 R87.1
NetC97_2: C97.2 R87.2 VD21.3 ; port ECG_CH_19
NetC98_2: C98.2 R88.2 R89.1
NetC99_2: C99.2 R89.2 VD22.3 ; port ECG_CH_20
NetR70_1: R70.1 ; port ECG_CH_11_OUT
NetR72_1: R72.1 ; port ECG_CH_12_OUT
NetR74_1: R74.1 ; port ECG_CH_13_OUT
NetR76_1: R76.1 ; port ECG_CH_14_OUT
NetR78_1: R78.1 ; port ECG_CH_15_OUT
NetR80_1: R80.1 ; port ECG_CH_16_OUT
NetR82_1: R82.1 ; port ECG_CH_17_OUT
NetR84_1: R84.1 ; port ECG_CH_18_OUT
NetR86_1: R86.1 ; port ECG_CH_19_OUT
NetR88_1: R88.1 ; port ECG_CH_20_OUT

### Notes on the sheet
- Перв. примен.
- Справ. №
- Подп. и дата
- Инв. № дубл.
- Взам. инв. №
- Разраб.
- Изм.
- Лист
- № докум.
- Подп.
- Дата
- Лит.
- Масса
- Масштаб
- Пров.
- Т.контр.
- Листов
- Инв. № подл.
- Утв.
- Н.контр.
- 2.106-A3
- Копировал
- Формат А3

### Library data of the parts
C80-C99 = CC_SMD_0603: Ceramic Capacitor SMD; Package: 0603; Value: 47pF
R70-R89 = R0603: Resistor SMD
  R70 R72 R74 R76 R78 R80 R82 R84 R86 R88: Value: 22.1K
  R71 R73 R75 R77 R79 R81 R83 R85 R87 R89: Value: 10K
VD13-VD22 = DIODE_BAV199: Diod Schottky; Diode Type: Standard; Package: SOT-23; PartNumber: BAV199; Manufacturer Part Number 1: BAV199

## Sheet Filter3.SchDoc
size 420 x 297 mm; SheetNumber: 8; SheetTotal: 13
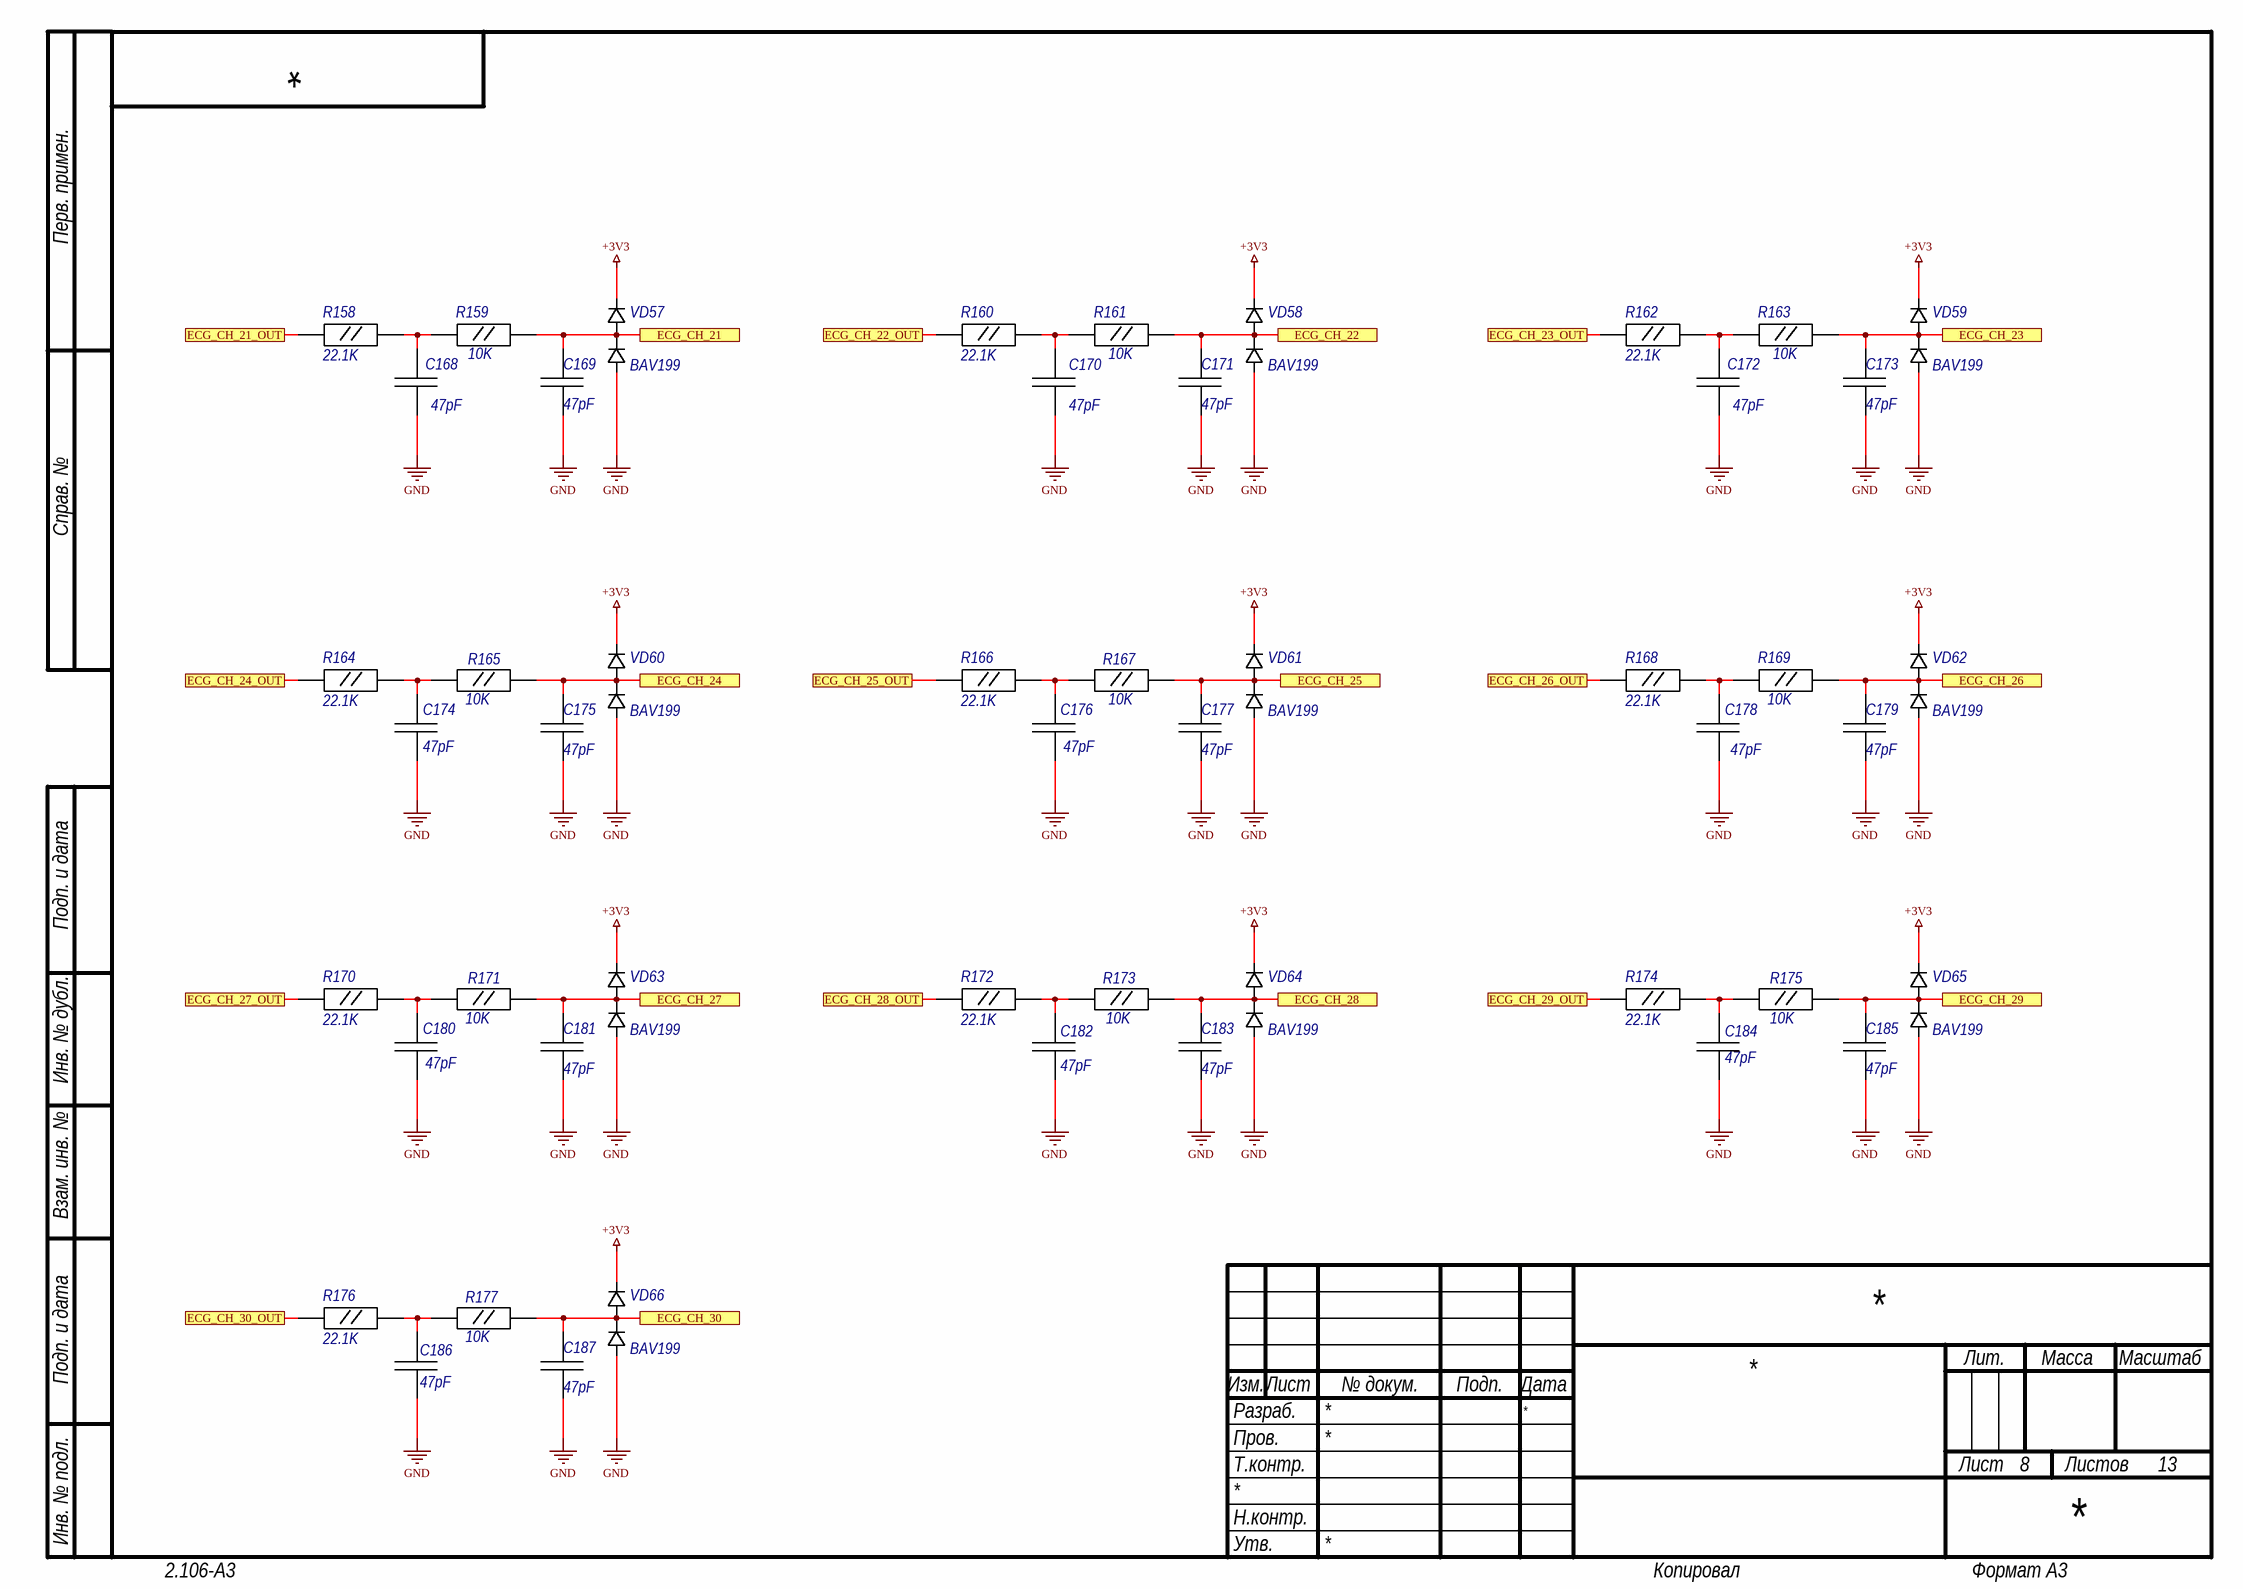
[diagram p7: Filter3.SchDoc]

### Parts
C168  47pF  [C0603]
C169  47pF  [C0603]
C170  47pF  [C0603]
C171  47pF  [C0603]
C172  47pF  [C0603]
C173  47pF  [C0603]
C174  47pF  [C0603]
C175  47pF  [C0603]
C176  47pF  [C0603]
C177  47pF  [C0603]
C178  47pF  [C0603]
C179  47pF  [C0603]
C180  47pF  [C0603]
C181  47pF  [C0603]
C182  47pF  [C0603]
C183  47pF  [C0603]
C184  47pF  [C0603]
C185  47pF  [C0603]
C186  47pF  [C0603]
C187  47pF  [C0603]
R158  22.1K  [R0603]
R159  10K  [R0603]
R160  22.1K  [R0603]
R161  10K  [R0603]
R162  22.1K  [R0603]
R163  10K  [R0603]
R164  22.1K  [R0603]
R165  10K  [R0603]
R166  22.1K  [R0603]
R167  10K  [R0603]
R168  22.1K  [R0603]
R169  10K  [R0603]
R170  22.1K  [R0603]
R171  10K  [R0603]
R172  22.1K  [R0603]
R173  10K  [R0603]
R174  22.1K  [R0603]
R175  10K  [R0603]
R176  22.1K  [R0603]
R177  10K  [R0603]
VD57  BAV199  [SOT23]
VD58  BAV199  [SOT23]
VD59  BAV199  [SOT23]
VD60  BAV199  [SOT23]
VD61  BAV199  [SOT23]
VD62  BAV199  [SOT23]
VD63  BAV199  [SOT23]
VD64  BAV199  [SOT23]
VD65  BAV199  [SOT23]
VD66  BAV199  [SOT23]

### Ports
ECG_CH_21, ECG_CH_21_OUT, ECG_CH_22, ECG_CH_22_OUT, ECG_CH_23, ECG_CH_23_OUT, ECG_CH_24, ECG_CH_24_OUT, ECG_CH_25, ECG_CH_25_OUT, ECG_CH_26, ECG_CH_26_OUT, ECG_CH_27, ECG_CH_27_OUT, ECG_CH_28, ECG_CH_28_OUT, ECG_CH_29, ECG_CH_29_OUT, ECG_CH_30, ECG_CH_30_OUT

### Nets
+3V3: VD57.2 VD58.2 VD59.2 VD60.2 VD61.2 VD62.2 VD63.2 VD64.2 VD65.2 VD66.2
GND: C168.1 C169.1 C170.1 C171.1 C172.1 C173.1 C174.1 C175.1 C176.1 C177.1 C178.1 C179.1 C180.1 C181.1 C182.1 C183.1 C184.1 C185.1 C186.1 C187.1 VD57.1 VD58.1 VD59.1 VD60.1 VD61.1 VD62.1 VD63.1 VD64.1 VD65.1 VD66.1
NetC168_2: C168.2 R158.2 R159.1
NetC169_2: C169.2 R159.2 VD57.3 ; port ECG_CH_21
NetC170_2: C170.2 R160.2 R161.1
NetC171_2: C171.2 R161.2 VD58.3 ; port ECG_CH_22
NetC172_2: C172.2 R162.2 R163.1
NetC173_2: C173.2 R163.2 VD59.3 ; port ECG_CH_23
NetC174_2: C174.2 R164.2 R165.1
NetC175_2: C175.2 R165.2 VD60.3 ; port ECG_CH_24
NetC176_2: C176.2 R166.2 R167.1
NetC177_2: C177.2 R167.2 VD61.3 ; port ECG_CH_25
NetC178_2: C178.2 R168.2 R169.1
NetC179_2: C179.2 R169.2 VD62.3 ; port ECG_CH_26
NetC180_2: C180.2 R170.2 R171.1
NetC181_2: C181.2 R171.2 VD63.3 ; port ECG_CH_27
NetC182_2: C182.2 R172.2 R173.1
NetC183_2: C183.2 R173.2 VD64.3 ; port ECG_CH_28
NetC184_2: C184.2 R174.2 R175.1
NetC185_2: C185.2 R175.2 VD65.3 ; port ECG_CH_29
NetC186_2: C186.2 R176.2 R177.1
NetC187_2: C187.2 R177.2 VD66.3 ; port ECG_CH_30
NetR158_1: R158.1 ; port ECG_CH_21_OUT
NetR160_1: R160.1 ; port ECG_CH_22_OUT
NetR162_1: R162.1 ; port ECG_CH_23_OUT
NetR164_1: R164.1 ; port ECG_CH_24_OUT
NetR166_1: R166.1 ; port ECG_CH_25_OUT
NetR168_1: R168.1 ; port ECG_CH_26_OUT
NetR170_1: R170.1 ; port ECG_CH_27_OUT
NetR172_1: R172.1 ; port ECG_CH_28_OUT
NetR174_1: R174.1 ; port ECG_CH_29_OUT
NetR176_1: R176.1 ; port ECG_CH_30_OUT

### Notes on the sheet
- Перв. примен.
- Справ. №
- Подп. и дата
- Инв. № дубл.
- Взам. инв. №
- Разраб.
- Изм.
- Лист
- № докум.
- Подп.
- Дата
- Лит.
- Масса
- Масштаб
- Пров.
- Т.контр.
- Листов
- Инв. № подл.
- Утв.
- Н.контр.
- 2.106-A3
- Копировал
- Формат А3

### Library data of the parts
C168-C187 = CC_SMD_0603: Ceramic Capacitor SMD; Package: 0603; Value: 47pF
R158-R177 = R0603: Resistor SMD
  R158 R160 R162 R164 R166 R168 R170 R172 R174 R176: Value: 22.1K
  R159 R161 R163 R165 R167 R169 R171 R173 R175 R177: Value: 10K
VD57-VD66 = DIODE_BAV199: Diod Schottky; Diode Type: Standard; Package: SOT-23; PartNumber: BAV199; Manufacturer Part Number 1: BAV199

## Sheet Filter4.SchDoc
size 420 x 297 mm; SheetNumber: 9; SheetTotal: 13
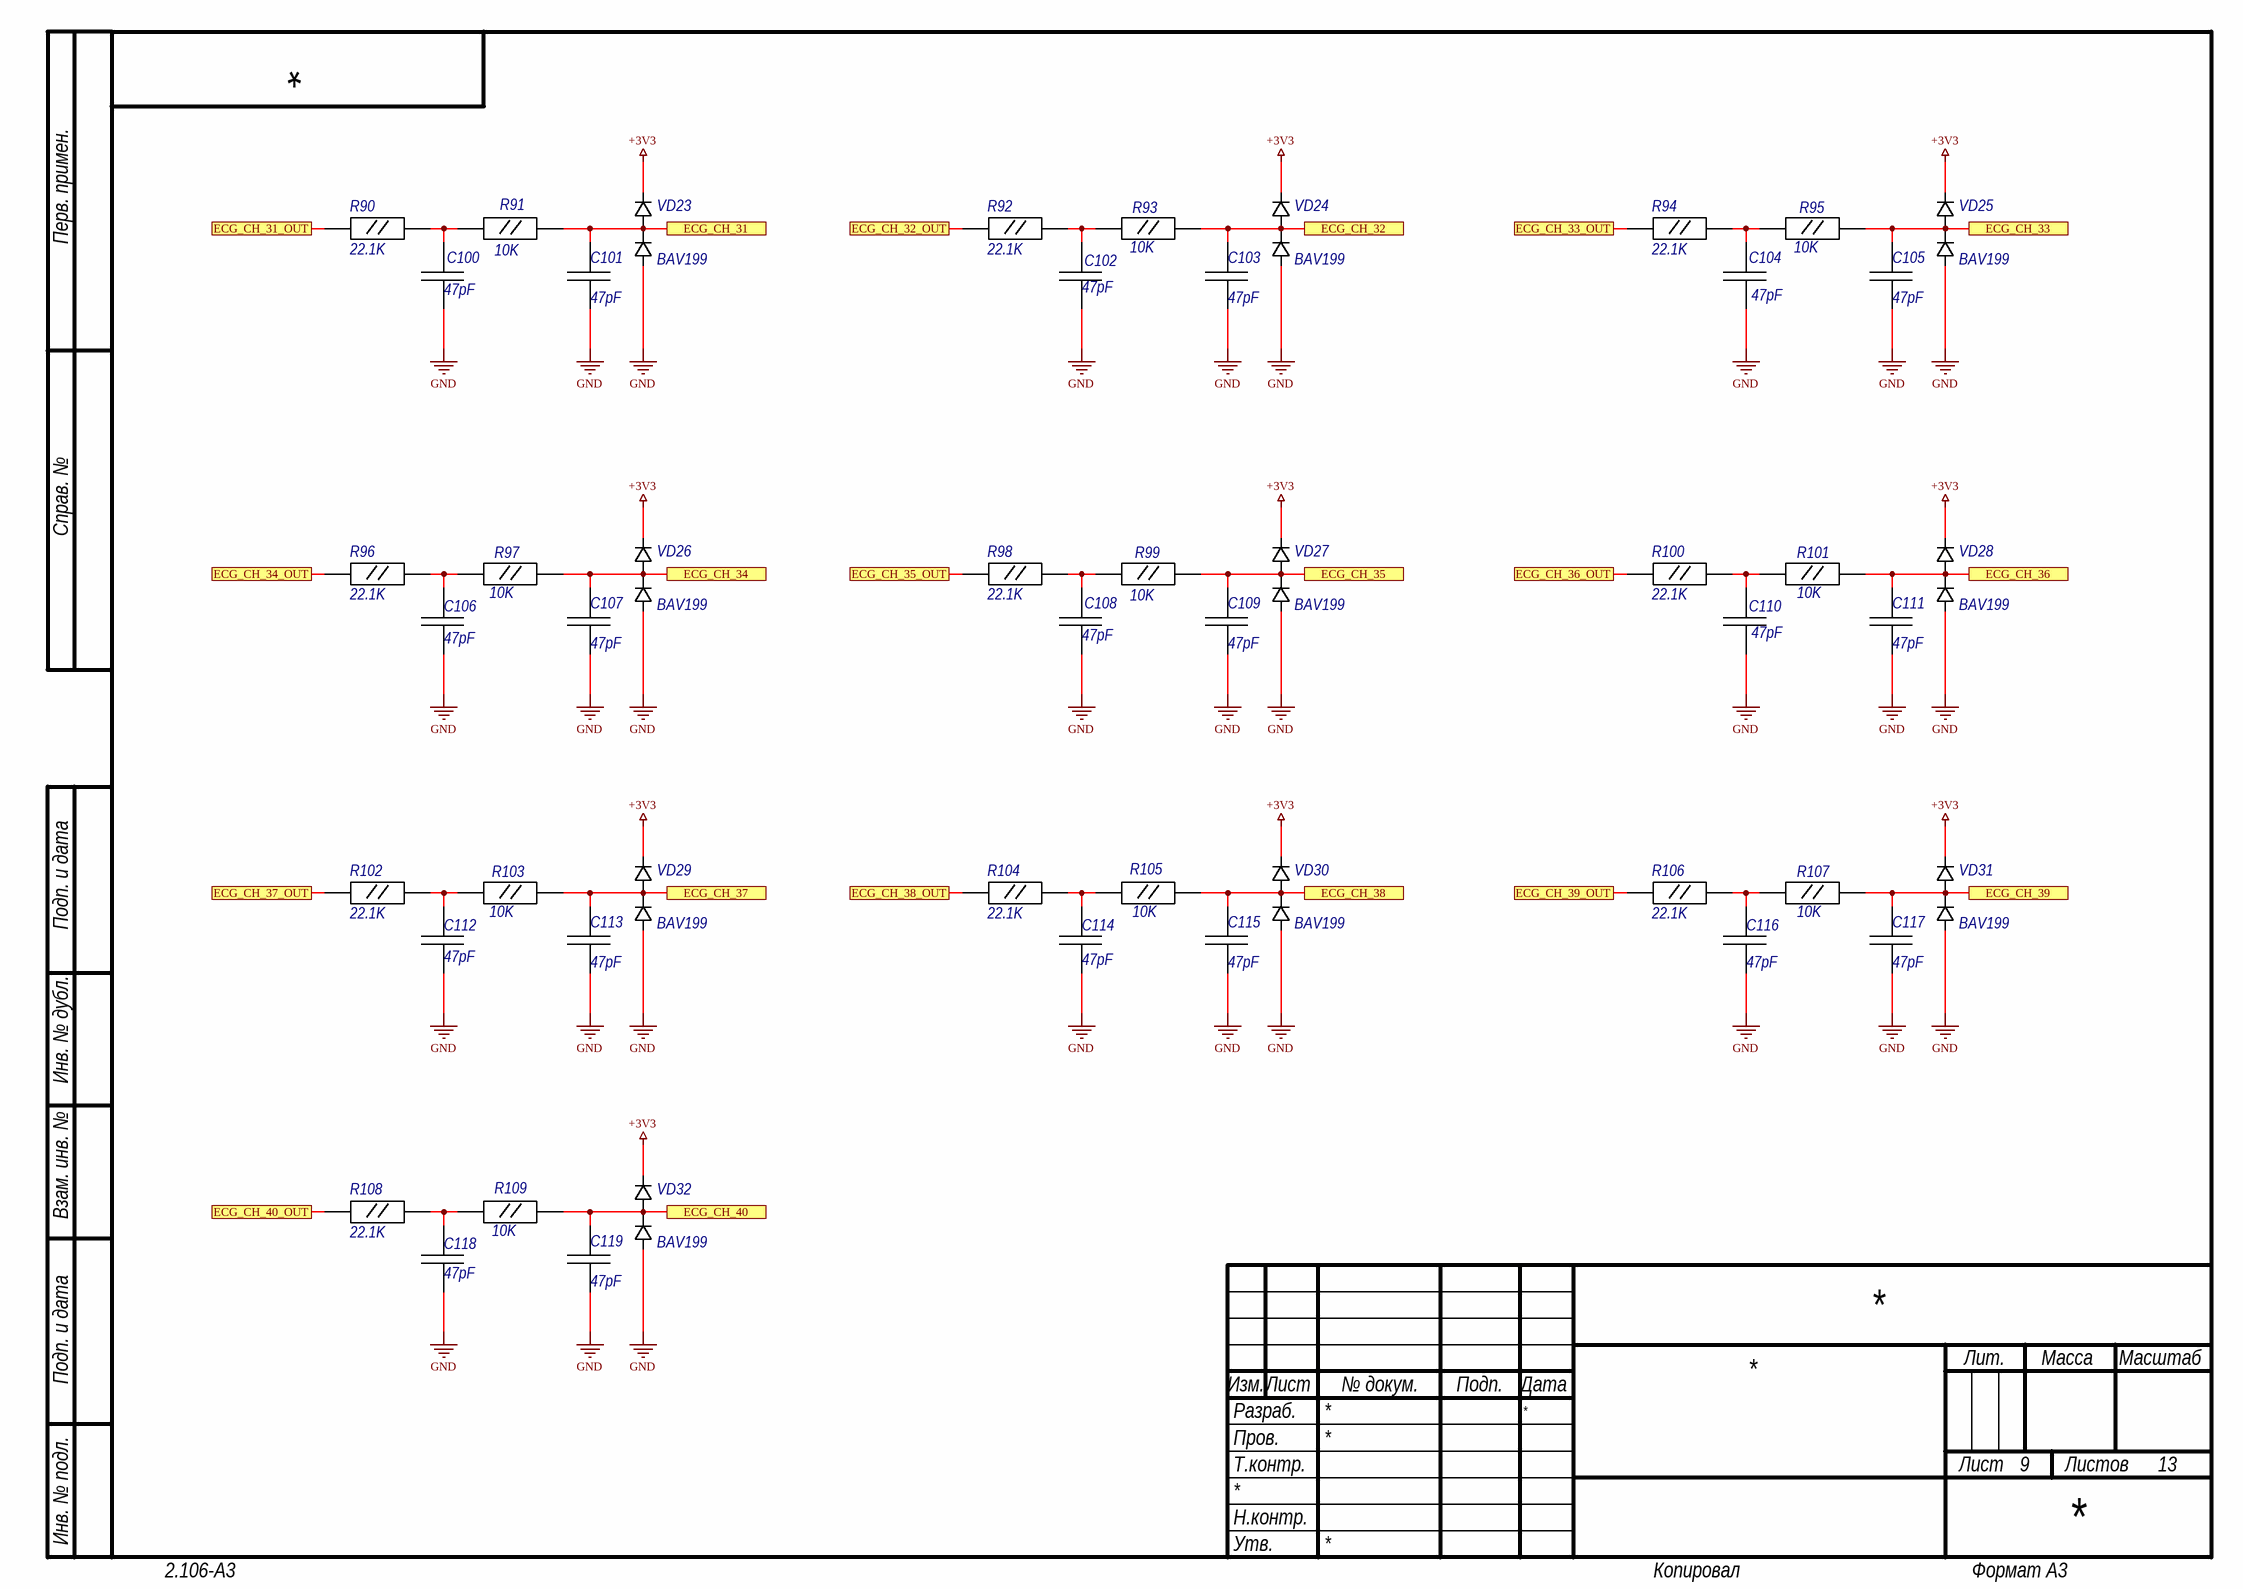
[diagram p8: Filter4.SchDoc]

### Parts
C100  47pF  [C0603]
C101  47pF  [C0603]
C102  47pF  [C0603]
C103  47pF  [C0603]
C104  47pF  [C0603]
C105  47pF  [C0603]
C106  47pF  [C0603]
C107  47pF  [C0603]
C108  47pF  [C0603]
C109  47pF  [C0603]
C110  47pF  [C0603]
C111  47pF  [C0603]
C112  47pF  [C0603]
C113  47pF  [C0603]
C114  47pF  [C0603]
C115  47pF  [C0603]
C116  47pF  [C0603]
C117  47pF  [C0603]
C118  47pF  [C0603]
C119  47pF  [C0603]
R90  22.1K  [R0603]
R91  10K  [R0603]
R92  22.1K  [R0603]
R93  10K  [R0603]
R94  22.1K  [R0603]
R95  10K  [R0603]
R96  22.1K  [R0603]
R97  10K  [R0603]
R98  22.1K  [R0603]
R99  10K  [R0603]
R100  22.1K  [R0603]
R101  10K  [R0603]
R102  22.1K  [R0603]
R103  10K  [R0603]
R104  22.1K  [R0603]
R105  10K  [R0603]
R106  22.1K  [R0603]
R107  10K  [R0603]
R108  22.1K  [R0603]
R109  10K  [R0603]
VD23  BAV199  [SOT23]
VD24  BAV199  [SOT23]
VD25  BAV199  [SOT23]
VD26  BAV199  [SOT23]
VD27  BAV199  [SOT23]
VD28  BAV199  [SOT23]
VD29  BAV199  [SOT23]
VD30  BAV199  [SOT23]
VD31  BAV199  [SOT23]
VD32  BAV199  [SOT23]

### Ports
ECG_CH_31, ECG_CH_31_OUT, ECG_CH_32, ECG_CH_32_OUT, ECG_CH_33, ECG_CH_33_OUT, ECG_CH_34, ECG_CH_34_OUT, ECG_CH_35, ECG_CH_35_OUT, ECG_CH_36, ECG_CH_36_OUT, ECG_CH_37, ECG_CH_37_OUT, ECG_CH_38, ECG_CH_38_OUT, ECG_CH_39, ECG_CH_39_OUT, ECG_CH_40, ECG_CH_40_OUT

### Nets
+3V3: VD23.2 VD24.2 VD25.2 VD26.2 VD27.2 VD28.2 VD29.2 VD30.2 VD31.2 VD32.2
GND: C100.1 C101.1 C102.1 C103.1 C104.1 C105.1 C106.1 C107.1 C108.1 C109.1 C110.1 C111.1 C112.1 C113.1 C114.1 C115.1 C116.1 C117.1 C118.1 C119.1 VD23.1 VD24.1 VD25.1 VD26.1 VD27.1 VD28.1 VD29.1 VD30.1 VD31.1 VD32.1
NetC100_2: C100.2 R90.2 R91.1
NetC101_2: C101.2 R91.2 VD23.3 ; port ECG_CH_31
NetC102_2: C102.2 R92.2 R93.1
NetC103_2: C103.2 R93.2 VD24.3 ; port ECG_CH_32
NetC104_2: C104.2 R94.2 R95.1
NetC105_2: C105.2 R95.2 VD25.3 ; port ECG_CH_33
NetC106_2: C106.2 R96.2 R97.1
NetC107_2: C107.2 R97.2 VD26.3 ; port ECG_CH_34
NetC108_2: C108.2 R98.2 R99.1
NetC109_2: C109.2 R99.2 VD27.3 ; port ECG_CH_35
NetC110_2: C110.2 R100.2 R101.1
NetC111_2: C111.2 R101.2 VD28.3 ; port ECG_CH_36
NetC112_2: C112.2 R102.2 R103.1
NetC113_2: C113.2 R103.2 VD29.3 ; port ECG_CH_37
NetC114_2: C114.2 R104.2 R105.1
NetC115_2: C115.2 R105.2 VD30.3 ; port ECG_CH_38
NetC116_2: C116.2 R106.2 R107.1
NetC117_2: C117.2 R107.2 VD31.3 ; port ECG_CH_39
NetC118_2: C118.2 R108.2 R109.1
NetC119_2: C119.2 R109.2 VD32.3 ; port ECG_CH_40
NetR90_1: R90.1 ; port ECG_CH_31_OUT
NetR92_1: R92.1 ; port ECG_CH_32_OUT
NetR94_1: R94.1 ; port ECG_CH_33_OUT
NetR96_1: R96.1 ; port ECG_CH_34_OUT
NetR98_1: R98.1 ; port ECG_CH_35_OUT
NetR100_1: R100.1 ; port ECG_CH_36_OUT
NetR102_1: R102.1 ; port ECG_CH_37_OUT
NetR104_1: R104.1 ; port ECG_CH_38_OUT
NetR106_1: R106.1 ; port ECG_CH_39_OUT
NetR108_1: R108.1 ; port ECG_CH_40_OUT

### Notes on the sheet
- Перв. примен.
- Справ. №
- Подп. и дата
- Инв. № дубл.
- Взам. инв. №
- Разраб.
- Изм.
- Лист
- № докум.
- Подп.
- Дата
- Лит.
- Масса
- Масштаб
- Пров.
- Т.контр.
- Листов
- Инв. № подл.
- Утв.
- Н.контр.
- 2.106-A3
- Копировал
- Формат А3

### Library data of the parts
C100-C119 = CC_SMD_0603: Ceramic Capacitor SMD; Package: 0603; Value: 47pF
R90-R109 = R0603: Resistor SMD
  R90 R92 R94 R96 R98 R100 R102 R104 R106 R108: Value: 22.1K
  R91 R93 R95 R97 R99 R101 R103 R105 R107 R109: Value: 10K
VD23-VD32 = DIODE_BAV199: Diod Schottky; Diode Type: Standard; Package: SOT-23; PartNumber: BAV199; Manufacturer Part Number 1: BAV199

## Sheet Filter5.SchDoc
size 420 x 297 mm; SheetNumber: 10; SheetTotal: 13
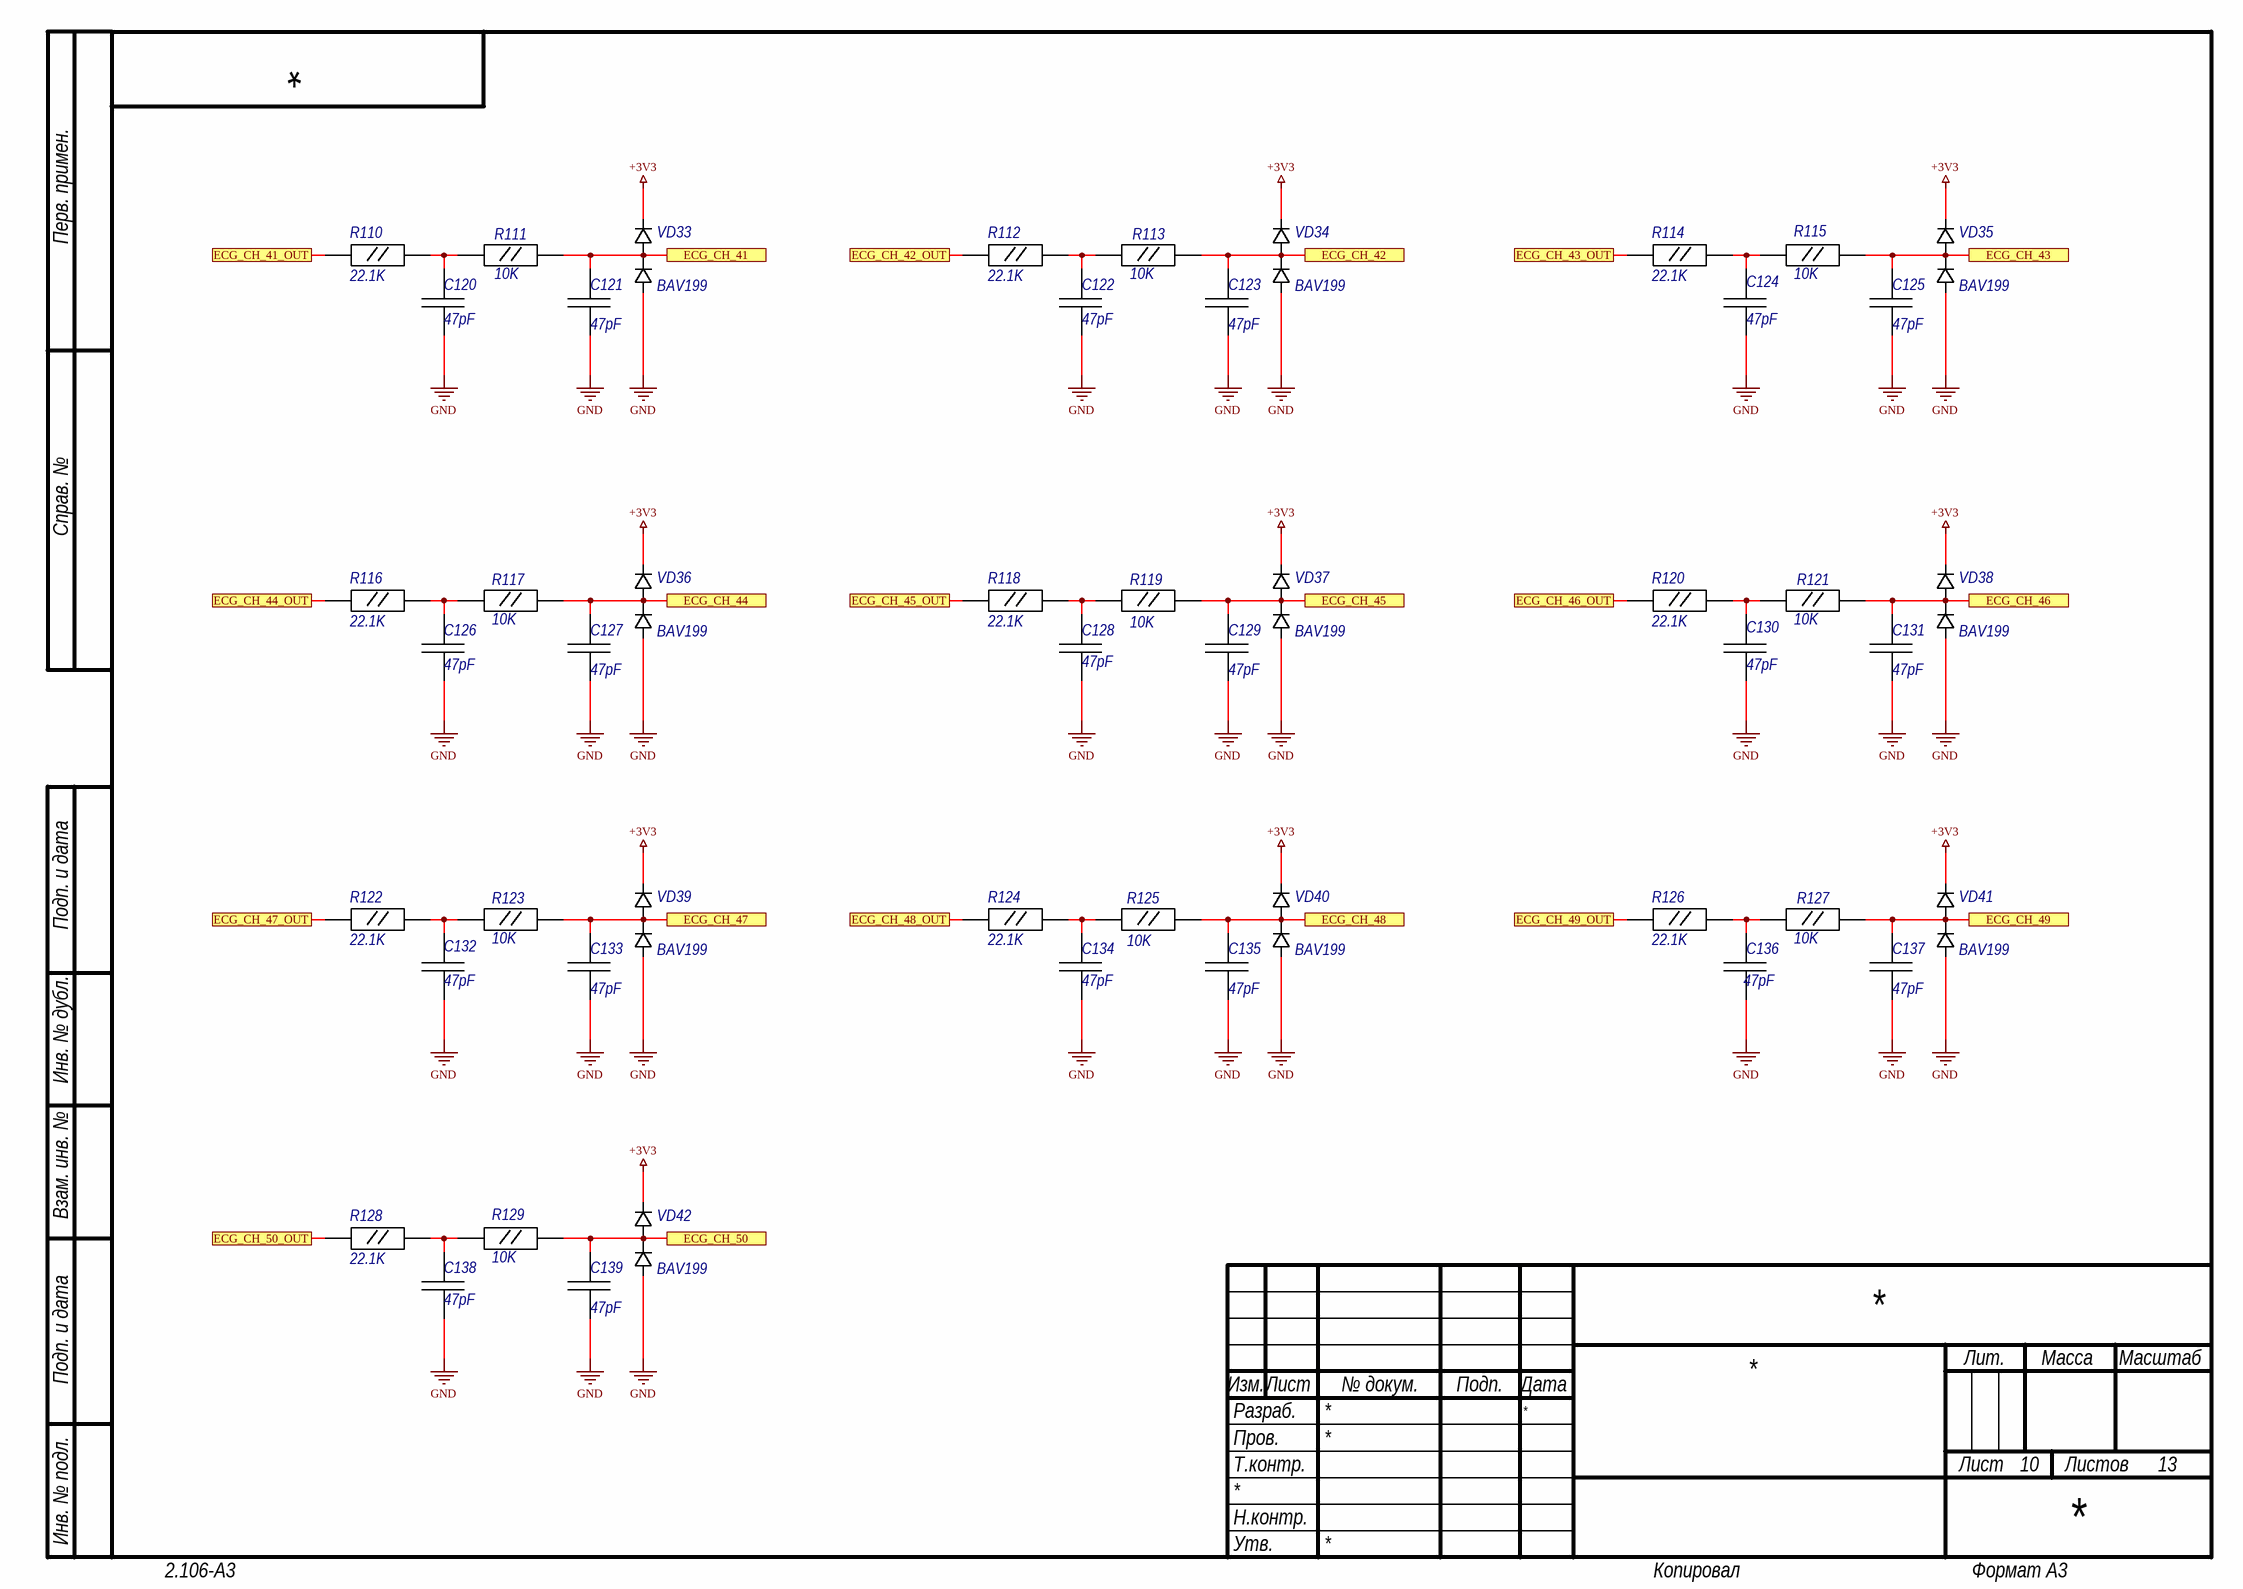
[diagram p9: Filter5.SchDoc]

### Parts
C120  47pF  [C0603]
C121  47pF  [C0603]
C122  47pF  [C0603]
C123  47pF  [C0603]
C124  47pF  [C0603]
C125  47pF  [C0603]
C126  47pF  [C0603]
C127  47pF  [C0603]
C128  47pF  [C0603]
C129  47pF  [C0603]
C130  47pF  [C0603]
C131  47pF  [C0603]
C132  47pF  [C0603]
C133  47pF  [C0603]
C134  47pF  [C0603]
C135  47pF  [C0603]
C136  47pF  [C0603]
C137  47pF  [C0603]
C138  47pF  [C0603]
C139  47pF  [C0603]
R110  22.1K  [R0603]
R111  10K  [R0603]
R112  22.1K  [R0603]
R113  10K  [R0603]
R114  22.1K  [R0603]
R115  10K  [R0603]
R116  22.1K  [R0603]
R117  10K  [R0603]
R118  22.1K  [R0603]
R119  10K  [R0603]
R120  22.1K  [R0603]
R121  10K  [R0603]
R122  22.1K  [R0603]
R123  10K  [R0603]
R124  22.1K  [R0603]
R125  10K  [R0603]
R126  22.1K  [R0603]
R127  10K  [R0603]
R128  22.1K  [R0603]
R129  10K  [R0603]
VD33  BAV199  [SOT23]
VD34  BAV199  [SOT23]
VD35  BAV199  [SOT23]
VD36  BAV199  [SOT23]
VD37  BAV199  [SOT23]
VD38  BAV199  [SOT23]
VD39  BAV199  [SOT23]
VD40  BAV199  [SOT23]
VD41  BAV199  [SOT23]
VD42  BAV199  [SOT23]

### Ports
ECG_CH_41, ECG_CH_41_OUT, ECG_CH_42, ECG_CH_42_OUT, ECG_CH_43, ECG_CH_43_OUT, ECG_CH_44, ECG_CH_44_OUT, ECG_CH_45, ECG_CH_45_OUT, ECG_CH_46, ECG_CH_46_OUT, ECG_CH_47, ECG_CH_47_OUT, ECG_CH_48, ECG_CH_48_OUT, ECG_CH_49, ECG_CH_49_OUT, ECG_CH_50, ECG_CH_50_OUT

### Nets
+3V3: VD33.2 VD34.2 VD35.2 VD36.2 VD37.2 VD38.2 VD39.2 VD40.2 VD41.2 VD42.2
GND: C120.1 C121.1 C122.1 C123.1 C124.1 C125.1 C126.1 C127.1 C128.1 C129.1 C130.1 C131.1 C132.1 C133.1 C134.1 C135.1 C136.1 C137.1 C138.1 C139.1 VD33.1 VD34.1 VD35.1 VD36.1 VD37.1 VD38.1 VD39.1 VD40.1 VD41.1 VD42.1
NetC120_2: C120.2 R110.2 R111.1
NetC121_2: C121.2 R111.2 VD33.3 ; port ECG_CH_41
NetC122_2: C122.2 R112.2 R113.1
NetC123_2: C123.2 R113.2 VD34.3 ; port ECG_CH_42
NetC124_2: C124.2 R114.2 R115.1
NetC125_2: C125.2 R115.2 VD35.3 ; port ECG_CH_43
NetC126_2: C126.2 R116.2 R117.1
NetC127_2: C127.2 R117.2 VD36.3 ; port ECG_CH_44
NetC128_2: C128.2 R118.2 R119.1
NetC129_2: C129.2 R119.2 VD37.3 ; port ECG_CH_45
NetC130_2: C130.2 R120.2 R121.1
NetC131_2: C131.2 R121.2 VD38.3 ; port ECG_CH_46
NetC132_2: C132.2 R122.2 R123.1
NetC133_2: C133.2 R123.2 VD39.3 ; port ECG_CH_47
NetC134_2: C134.2 R124.2 R125.1
NetC135_2: C135.2 R125.2 VD40.3 ; port ECG_CH_48
NetC136_2: C136.2 R126.2 R127.1
NetC137_2: C137.2 R127.2 VD41.3 ; port ECG_CH_49
NetC138_2: C138.2 R128.2 R129.1
NetC139_2: C139.2 R129.2 VD42.3 ; port ECG_CH_50
NetR110_1: R110.1 ; port ECG_CH_41_OUT
NetR112_1: R112.1 ; port ECG_CH_42_OUT
NetR114_1: R114.1 ; port ECG_CH_43_OUT
NetR116_1: R116.1 ; port ECG_CH_44_OUT
NetR118_1: R118.1 ; port ECG_CH_45_OUT
NetR120_1: R120.1 ; port ECG_CH_46_OUT
NetR122_1: R122.1 ; port ECG_CH_47_OUT
NetR124_1: R124.1 ; port ECG_CH_48_OUT
NetR126_1: R126.1 ; port ECG_CH_49_OUT
NetR128_1: R128.1 ; port ECG_CH_50_OUT

### Notes on the sheet
- Перв. примен.
- Справ. №
- Подп. и дата
- Инв. № дубл.
- Взам. инв. №
- Разраб.
- Изм.
- Лист
- № докум.
- Подп.
- Дата
- Лит.
- Масса
- Масштаб
- Пров.
- Т.контр.
- Листов
- Инв. № подл.
- Утв.
- Н.контр.
- 2.106-A3
- Копировал
- Формат А3

### Library data of the parts
C120-C139 = CC_SMD_0603: Ceramic Capacitor SMD; Package: 0603; Value: 47pF
R110-R129 = R0603: Resistor SMD
  R110 R112 R114 R116 R118 R120 R122 R124 R126 R128: Value: 22.1K
  R111 R113 R115 R117 R119 R121 R123 R125 R127 R129: Value: 10K
VD33-VD42 = DIODE_BAV199: Diod Schottky; Diode Type: Standard; Package: SOT-23; PartNumber: BAV199; Manufacturer Part Number 1: BAV199